# EAGLE schematic AI_Starter_Kit_for_Jetson_Nano_V1.0 (EAGLE 9.5.1)

## Sheet 1 of 2
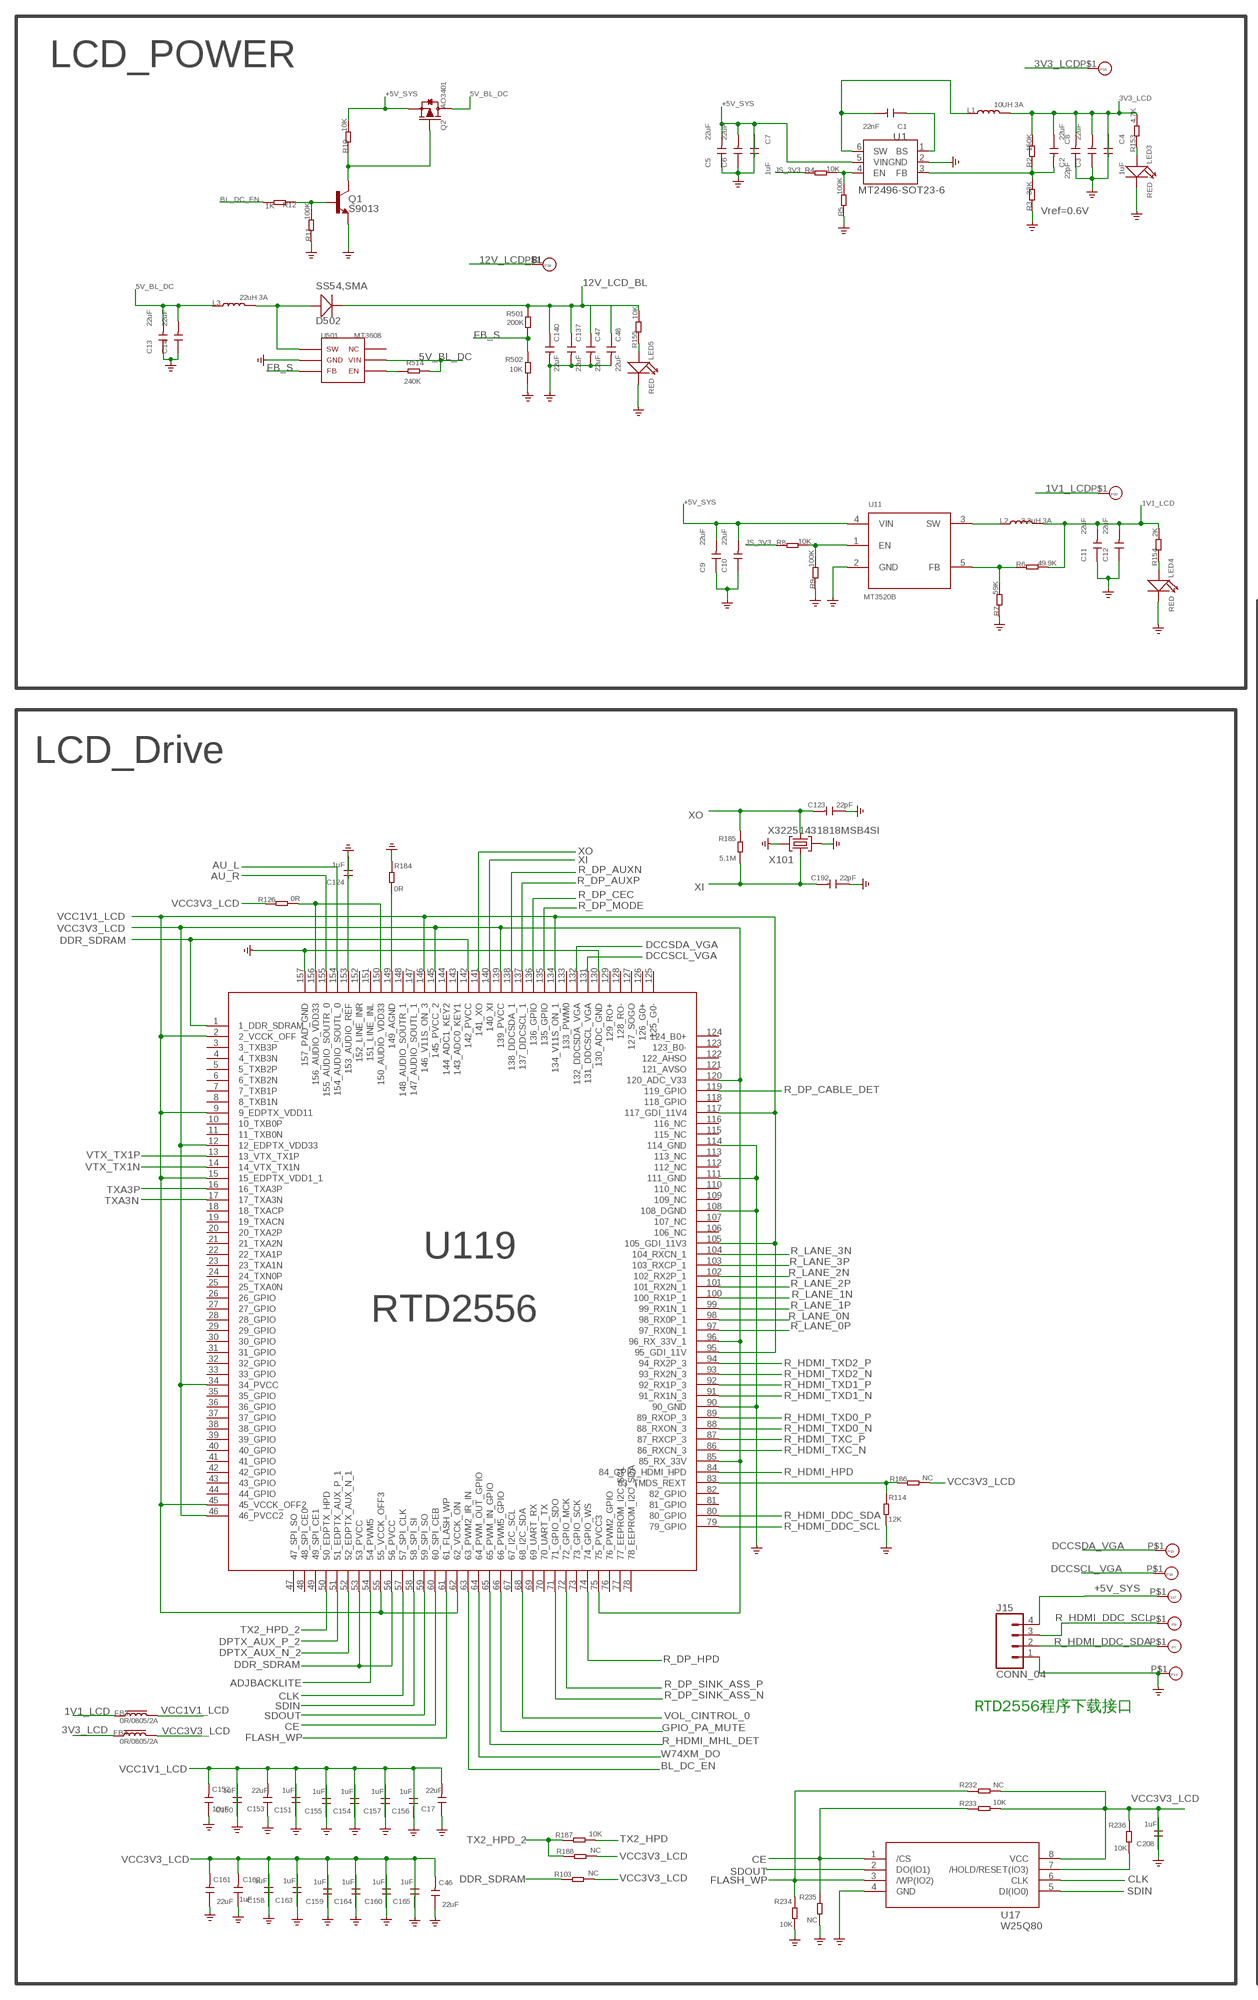
[diagram p0: schematic, sheet 1, part 1 of 2]
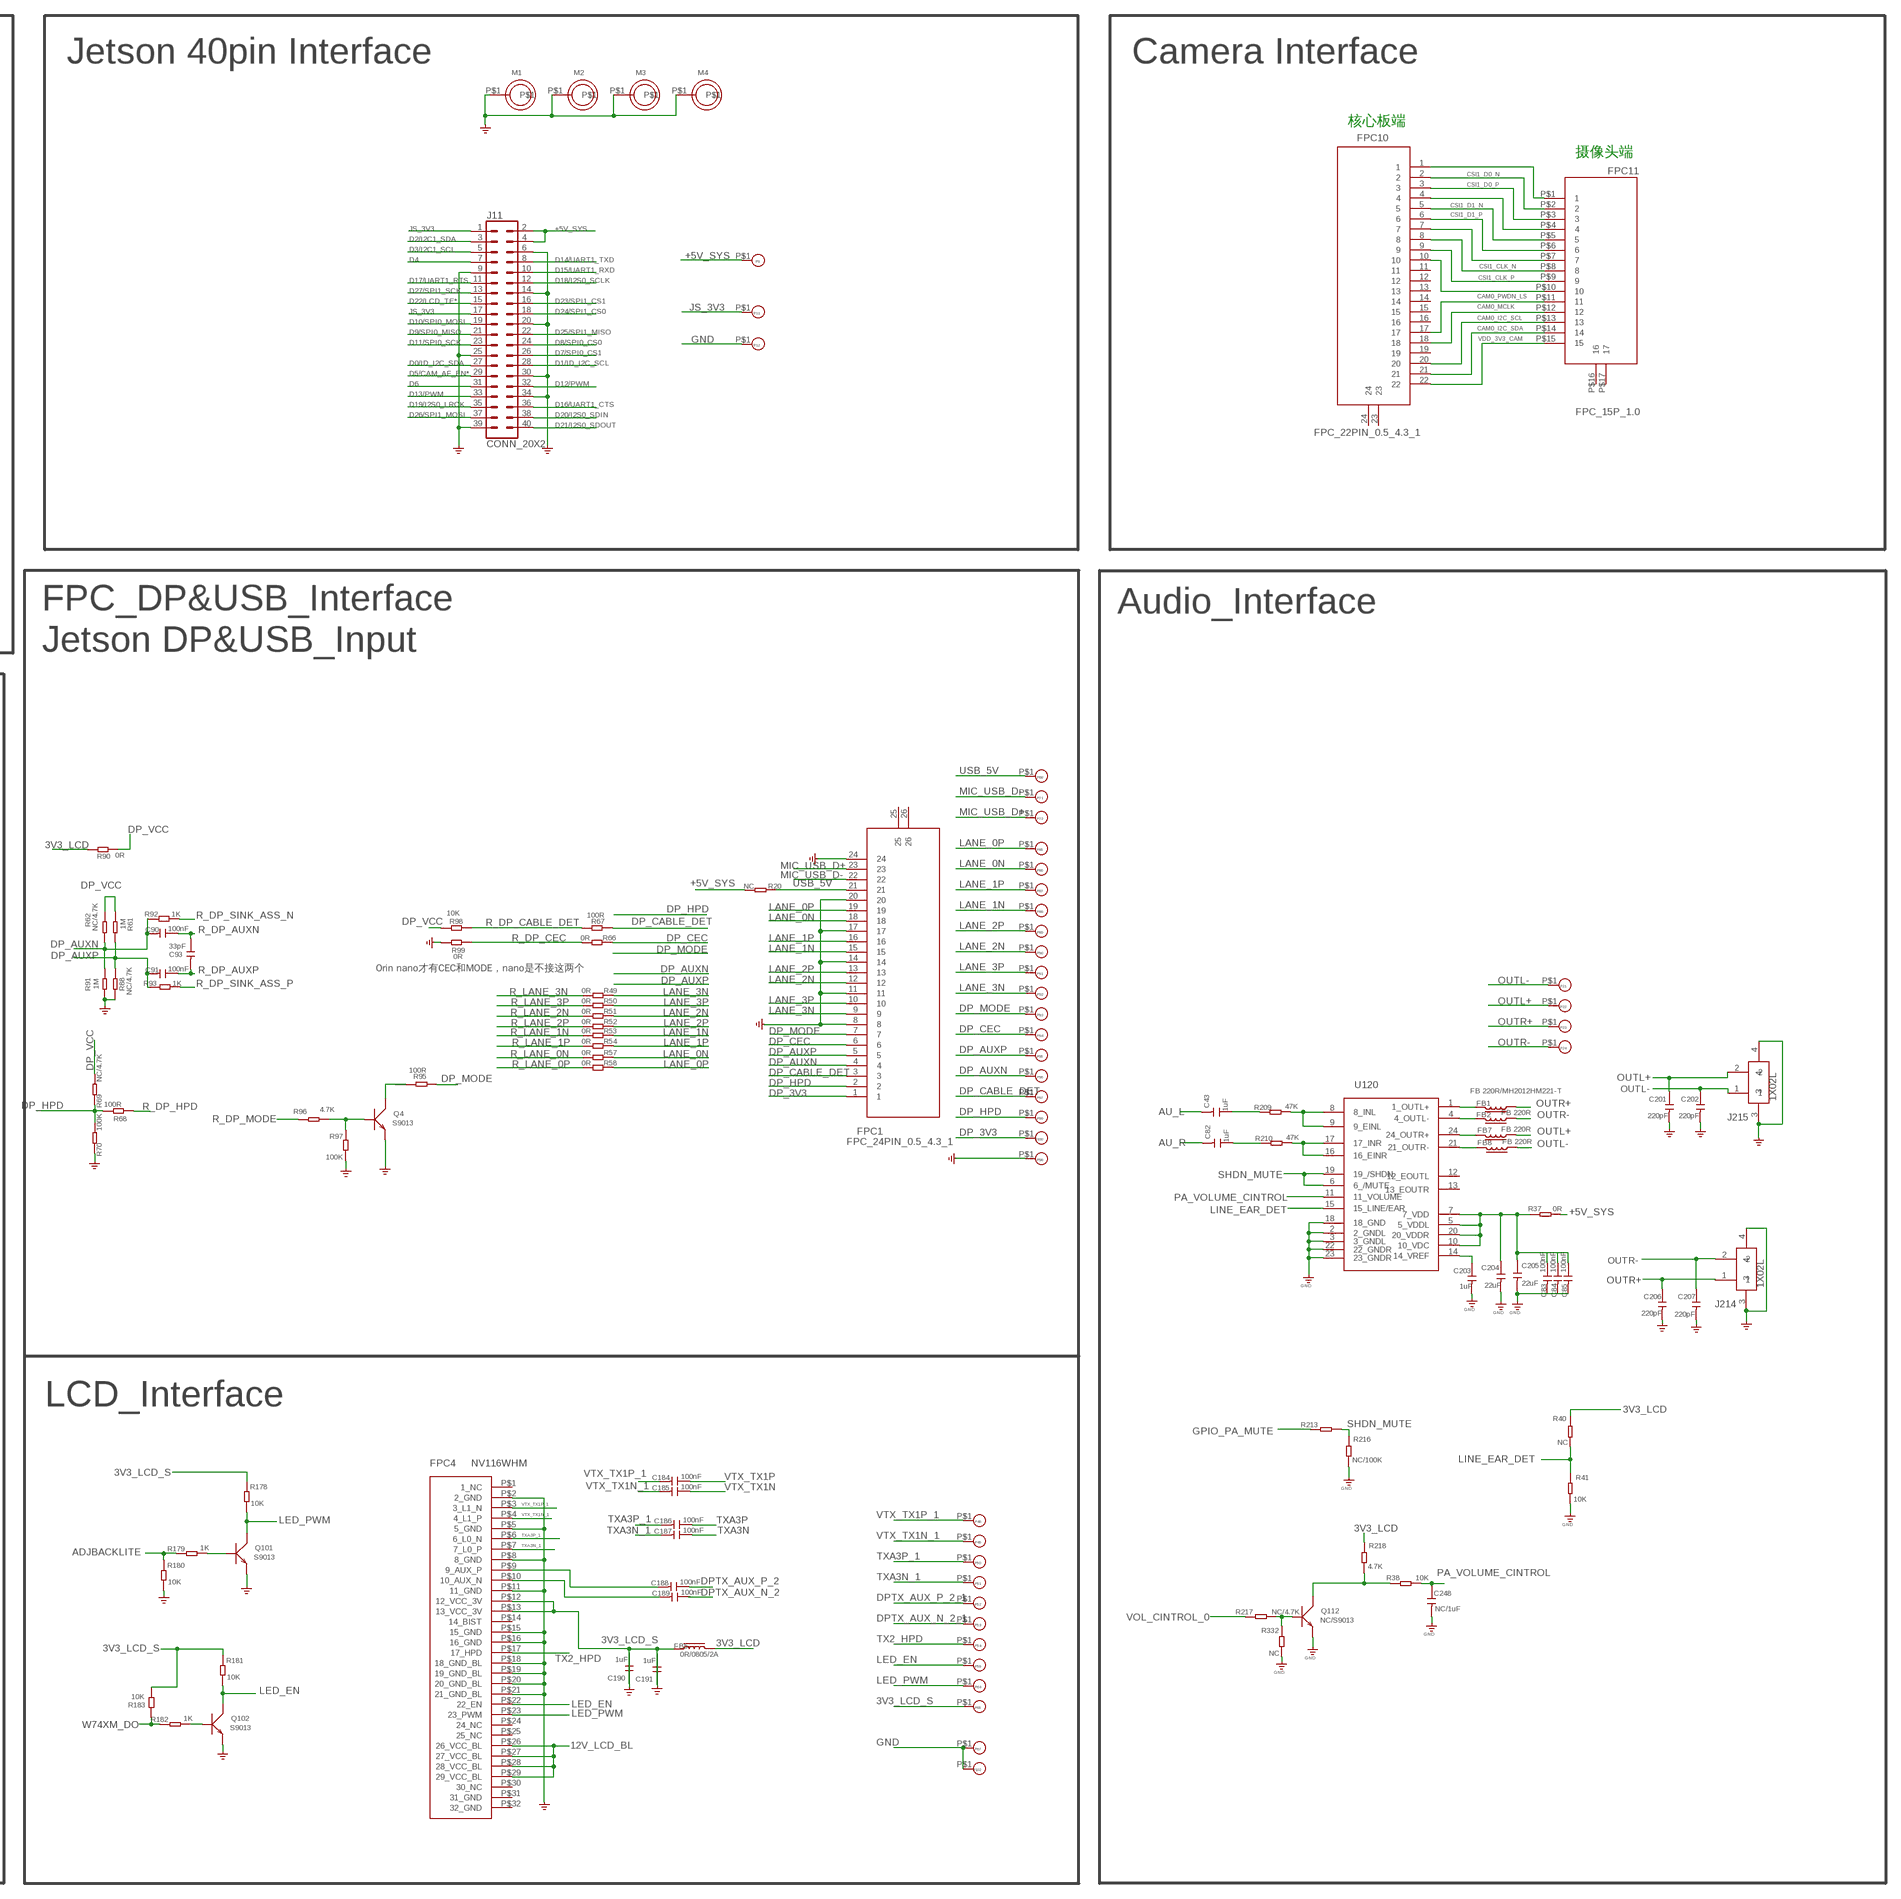
[diagram p1: schematic, sheet 1, part 2 of 2]

### Parts
C1  22nF  CAPC0603  [C0603]
C2  22uF  CAPC0805  [C0805]
C3  22uF  CAPC0805  [C0805]
C4  1uF  CAPC0603  [C0603]
C5  22uF  CAPC0805  [C0805]
C6  22uF  CAPC0805  [C0805]
C7  1uF  CAPC0603  [C0603]
C8  22pF  CAPC0603  [C0603]
C9  22uF  CAPC0805  [C0805]
C10  22uF  CAPC0805  [C0805]
C11  22uF  CAPC0805  [C0805]
C12  22uF  CAPC0805  [C0805]
C13  22uF  CAPC0805  [C0805]
C14  22uF  CAPC0805  [C0805]
C17  22uF  CAPC0805  [C0805]
C43  1uF  CAPC0603  [C0603]
C46  22uF  CAPC0805  [C0805]
C47  22uF  CAPC0805  [C0805]
C48  22uF  CAPC0805  [C0805]
C82  1uF  CAPC0603  [C0603]
C83  100nF  CAPC0603  [C0603]
C84  100nF  CAPC0603  [C0603]
C85  100nF  CAPC0603  [C0603]
C90  100nF  CAPC0402  [C0402]
C91  100nF  CAPC0402  [C0402]
C93  33pF  CAPC0402  [C0402]
C123  22pF  CAPC0603  [C0603]
C124  1uF  CAPC0603  [C0603]
C137  22uF  CAPC0805  [C0805]
C140  22uF  CAPC0805  [C0805]
C150  1uF  CAPC0603  [C0603]
C151  1uF  CAPC0603  [C0603]
C152  10uF  CAPC0805  [C0805]
C153  22uF  CAPC0805  [C0805]
C154  1uF  CAPC0603  [C0603]
C155  1uF  CAPC0603  [C0603]
C156  1uF  CAPC0603  [C0603]
C157  1uF  CAPC0603  [C0603]
C158  1uF  CAPC0603  [C0603]
C159  1uF  CAPC0603  [C0603]
C160  1uF  CAPC0603  [C0603]
C161  22uF  CAPC0805  [C0805]
C162  1uF  CAPC0603  [C0603]
C163  1uF  CAPC0603  [C0603]
C164  1uF  CAPC0603  [C0603]
C165  1uF  CAPC0603  [C0603]
C184  100nF  CAPC0603  [C0603]
C185  100nF  CAPC0603  [C0603]
C186  100nF  CAPC0603  [C0603]
C187  100nF  CAPC0603  [C0603]
C188  100nF  CAPC0603  [C0603]
C189  100nF  CAPC0603  [C0603]
C190  1uF  CAPC0603  [C0603]
C191  1uF  CAPC0603  [C0603]
C192  22pF  CAPC0603  [C0603]
C201  220pF  CAPC0603  [C0603]
C202  220pF  CAPC0603  [C0603]
C203  1uF  CAPC0603  [C0603]
C204  22uF  CAPC0805  [C0805]
C205  22uF  CAPC0805  [C0805]
C206  220pF  CAPC0603  [C0603]
C207  220pF  CAPC0603  [C0603]
C208  1uF  CAPC0603  [C0603]
C248  NC/1uF  CAPC0603  [C0603]
D502  SS54,SMA  214ABDO-214AB  [214AB]
FB1  FB 220R/MH2012HM221-T  FBL0805  [L0805]
FB2  FB 220R  FBL0805  [L0805]
FB3  0R/0805/2A  FBL0805  [L0805]
FB4  0R/0805/2A  FBL0805  [L0805]
FB5  0R/0805/2A  FBL0805  [L0805]
FB7  FB 220R  FBL0805  [L0805]
FB8  FB 220R  FBL0805  [L0805]
FPC1  FPC_24PIN_0.5_4.3_1  [FPC_24PIN_0.5_4.3_1]
FPC4  NV116WHM  [30P*0.5MM]
FPC10  FPC_22PIN_0.5_4.3_1  [FPC_22PIN_0.5_4.3_1]
FPC11  FPC_15P_1.0  [FPC_P1.0MM_15P_SMD]
J11  CONN_20X2  [2X20]
J15  CONN_04  [1X04]
J214  1X02L  [1X02L]
J215  1X02L  [1X02L]
L1  10UH 3A  LL773  [L773]
L2  3.3uH 3A  LL0420  [L0420]
L3  22uH 3A  LL773  [L773]
LED3  RED  DISCRETE_LED0603  [DISCRETE_LED-0603]
LED4  RED  DISCRETE_LED0603  [DISCRETE_LED-0603]
LED5  RED  DISCRETE_LED0603  [DISCRETE_LED-0603]
M1  M2  [M2]
M2  M2  [M2]
M3  M2  [M2]
M4  M2  [M2]
P7  PADPAD-1.0MM  [PAD-1.0MM]
P8  PADPAD-1.0MM  [PAD-1.0MM]
P9  PADPAD-1.0MM  [PAD-1.0MM]
P11  PADPAD-1.0MM  [PAD-1.0MM]
P12  PADPAD-1.0MM  [PAD-1.0MM]
P14  PADPAD-1.0MM  [PAD-1.0MM]
P15  PADPAD-1.0MM  [PAD-1.0MM]
P16  PADPAD-1.0MM  [PAD-1.0MM]
P18  PADPAD-1.0MM  [PAD-1.0MM]
P19  PADPAD-1.0MM  [PAD-1.0MM]
P20  PADPAD-1.0MM  [PAD-1.0MM]
P21  PADPAD-1.0MM  [PAD-1.0MM]
P22  PADPAD-1.0MM  [PAD-1.0MM]
P23  PADPAD-1.0MM  [PAD-1.0MM]
P24  PADPAD-1.0MM  [PAD-1.0MM]
P48  PADPAD-1.0MM  [PAD-1.0MM]
P49  PADPAD-1.0MM  [PAD-1.0MM]
P50  PADPAD-1.0MM  [PAD-1.0MM]
P51  PADPAD-1.0MM  [PAD-1.0MM]
P52  PADPAD-1.0MM  [PAD-1.0MM]
P53  PADPAD-1.0MM  [PAD-1.0MM]
P54  PADPAD-1.0MM  [PAD-1.0MM]
P58  PADPAD-1.0MM  [PAD-1.0MM]
P64  PADPAD-1.0MM  [PAD-1.0MM]
P65  PADPAD-1.0MM  [PAD-1.0MM]
P67  PADPAD-1.0MM  [PAD-1.0MM]
P68  PADPAD-1.0MM  [PAD-1.0MM]
P71  PADPAD-1.0MM  [PAD-1.0MM]
P72  PADPAD-1.0MM  [PAD-1.0MM]
P85  PADPAD-1.0MM  [PAD-1.0MM]
P86  PADPAD-1.0MM  [PAD-1.0MM]
P87  PADPAD-1.0MM  [PAD-1.0MM]
P88  PADPAD-1.0MM  [PAD-1.0MM]
P89  PADPAD-1.0MM  [PAD-1.0MM]
P90  PADPAD-1.0MM  [PAD-1.0MM]
P91  PADPAD-1.0MM  [PAD-1.0MM]
P92  PADPAD-1.0MM  [PAD-1.0MM]
P93  PADPAD-1.0MM  [PAD-1.0MM]
P94  PADPAD-1.0MM  [PAD-1.0MM]
P95  PADPAD-1.0MM  [PAD-1.0MM]
P96  PADPAD-1.0MM  [PAD-1.0MM]
P97  PADPAD-1.0MM  [PAD-1.0MM]
P98  PADPAD-1.0MM  [PAD-1.0MM]
P99  PADPAD-1.0MM  [PAD-1.0MM]
P100  PADPAD-1.0MM  [PAD-1.0MM]
P102  PADPAD-1.0MM  [PAD-1.0MM]
P117  PADPAD-1.0MM  [PAD-1.0MM]
Q1  S9013  TRANS_NPN-MMBTA42  [SOT23-3]
Q2  AO3401  MOSFET-PSOT23  [PMOS_SOT23]
Q4  S9013  TRANSISTOR-NPN-SOT23  [SOT23@1]
Q101  S9013  TRANSISTOR-NPN-SOT23  [SOT23@1]
Q102  S9013  TRANSISTOR-NPN-SOT23  [SOT23@1]
Q112  NC/S9013  TRANSISTOR-NPN-SOT23  [SOT23@1]
R2  150K  RESR0603  [R0603]
R3  33K  RESR0603  [R0603]
R4  10K  RESR0603  [R0603]
R5  100K  RESR0603  [R0603]
R6  49.9K  RESR0603  [R0603]
R7  59K  RESR0603  [R0603]
R8  10K  RESR0603  [R0603]
R9  100K  RESR0603  [R0603]
R10  10K  RESR0603  [R0603]
R11  100K  RESR0603  [R0603]
R12  1K  RESR0603  [R0603]
R20  NC  RESR0603  [R0603]
R37  0R  RESR0603  [R0603]
R38  10K  RESR0603  [R0603]
R40  NC  RESR0603  [R0603]
R41  10K  RESR0603  [R0603]
R49  0R  RESR0402  [R0402]
R50  0R  RESR0402  [R0402]
R51  0R  RESR0402  [R0402]
R52  0R  RESR0402  [R0402]
R53  0R  RESR0402  [R0402]
R54  0R  RESR0402  [R0402]
R57  0R  RESR0402  [R0402]
R58  0R  RESR0402  [R0402]
R61  1M  RESR0402  [R0402]
R62  NC/4.7K  RESR0402  [R0402]
R66  0R  RESR0402  [R0402]
R67  100R  RESR0402  [R0402]
R68  100R  RESR0402  [R0402]
R69  NC/4.7K  RESR0402  [R0402]
R70  100K  RESR0402  [R0402]
R88  NC/4.7K  RESR0402  [R0402]
R90  0R  RESR0402  [R0402]
R91  1M  RESR0402  [R0402]
R92  1K  RESR0402  [R0402]
R93  1K  RESR0402  [R0402]
R95  100R  RESR0402  [R0402]
R96  4.7K  RESR0402  [R0402]
R97  100K  RESR0402  [R0402]
R98  10K  RESR0402  [R0402]
R99  0R  RESR0402  [R0402]
R103  NC  RESR0603  [R0603]
R114  12K  RESR0603  [R0603]
R126  0R  RESR0603  [R0603]
R153  4.7K  RESR0603  [R0603]
R154  2K  RESR0603  [R0603]
R155  10K  RESR0603  [R0603]
R178  10K  RESR0603  [R0603]
R179  1K  RESR0603  [R0603]
R180  10K  RESR0603  [R0603]
R181  10K  RESR0603  [R0603]
R182  1K  RESR0603  [R0603]
R183  10K  RESR0603  [R0603]
R184  0R  RESR0603  [R0603]
R185  5.1M  RESR0603  [R0603]
R186  NC  RESR0603  [R0603]
R187  10K  RESR0603  [R0603]
R188  NC  RESR0603  [R0603]
R209  47K  RESR0603  [R0603]
R210  47K  RESR0603  [R0603]
R213  0R  RESR0603  [R0603]
R216  NC/100K  RESR0603  [R0603]
R217  NC/4.7K  RESR0603  [R0603]
R218  4.7K  RESR0603  [R0603]
R232  NC  RESR0603  [R0603]
R233  10K  RESR0603  [R0603]
R234  10K  RESR0603  [R0603]
R235  NC  RESR0603  [R0603]
R236  10K  RESR0603  [R0603]
R332  NC  RESR0603  [R0603]
R501  200K  RESR0603  [R0603]
R502  10K  RESR0603  [R0603]
R514  240K  RESR0603  [R0603]
U1  MT2496-SOT23-6  MT2492-SOT23-6  [SOT23-6L]
U11  MT3520B  [IC_SOT23-5]
U17  W25Q80  LORA_RA-08H_DEV_SELF_W25Q128JV  [LORA_RA-08H_DEV_SELF_SOIC-8-208MIL]
U119  RTD2556  IC_RTD2556_LQFP156_14X20  [IC_RTD2556_LQFP156_14X20]
U120  PAM8602E_SSOP24  [SSOP24]
U501  MT3608  [MT3608-SOT23-6]
X101  X32251431818MSB4SI  CRYSTAL-3.2-2.5  [CRYSTAL-3.2-2.5]

### Nets
1V1_LCD: C11.2 C12.2 FB3.1 L2.2 P20.P$1 R6.2 R154.2
3V3_AU: R126.2 U119.150(150_AUDIO_VDD33) U119.156(156_AUDIO_VDD33)
3V3_LCD: C2.2 C3.2 C4.2 C8.1 FB4.1 FB5.2 L1.2 P19.P$1 R2.2 R40.1 R90.1 R153.2 R218.2
3V3_LCD_S: C190.2 C191.2 FB5.1 FPC4.P$12(12_VCC_3V) FPC4.P$13(13_VCC_3V) P65.P$1 R178.2 R181.2 R183.2
5V_BL_DC: C13.2 C14.2 L3.1 Q2.3(D) R514.2 U501.5
12V_LCD_BL: C47.1 C48.1 C137.1 C140.1 D502.2(-) FPC4.P$26(26_VCC_BL) FPC4.P$27(27_VCC_BL) FPC4.P$28(28_VCC_BL) FPC4.P$29(29_VCC_BL) P18.P$1 R155.2 R501.1
+5V_SYS [PWR]: C5.2 C6.2 C7.2 C9.2 C10.2 J11.2 J11.4 J15.4 P9.P$1 P117.P$1 Q2.2(S) R10.2 R20.1 R37.2 U1.5(VIN) U11.4(VIN) ; also sheet 2
A_GND: R184.1 U119.149(149_AGND)
ADJBACKLITE: R179.2 R180.2 U119.54(54_PWM5)
AU_L: C43.2 U119.154(154_AUDIO_SOUTL_0)
AU_R: C82.2 U119.155(155_AUDIO_SOUTR_0)
BL_DC_EN: R12.2 U119.63(63_PWM2_IR_IN)
CAM0_I2C_SCL: FPC10.20 FPC11.P$13
CAM0_I2C_SDA: FPC10.21 FPC11.P$14
CAM0_MCLK: FPC10.18 FPC11.P$12
CAM0_PWDN_LS: FPC10.17 FPC11.P$11
CE: R233.2 R235.2 U17.1(/CS) U119.60(60_SPI_CEB)
CLK: U17.6(CLK) U119.57(57_SPI_CLK)
CSI1_CLK_N: FPC10.8 FPC11.P$8
CSI1_CLK_P: FPC10.9 FPC11.P$9
CSI1_D0_N: FPC10.2 FPC11.P$2
CSI1_D0_P: FPC10.3 FPC11.P$3
CSI1_D1_N: FPC10.5 FPC11.P$5
CSI1_D1_P: FPC10.6 FPC11.P$6
CSI_GND: FPC10.1 FPC10.4 FPC10.7 FPC10.10 FPC11.P$1 FPC11.P$4 FPC11.P$7 FPC11.P$10
D0/ID_I2C_SDA: J11.27
D1/ID_I2C_SCL: J11.28
D2/I2C1_SDA: J11.3 ; also sheet 2
D3/I2C1_SCL: J11.5 ; also sheet 2
D4: J11.7 ; also sheet 2
D5/CAM_AF_EN*: J11.29
D6: J11.31 ; also sheet 2
D7/SPI0_CS1: J11.26
D8/SPI0_CS0: J11.24 ; also sheet 2
D9/SPI0_MISO: J11.21 ; also sheet 2
D10/SPI0_MOSI: J11.19 ; also sheet 2
D11/SPI0_SCK: J11.23 ; also sheet 2
D12/PWM: J11.32 ; also sheet 2
D13/PWM: J11.33 ; also sheet 2
D14/UART1_TXD: J11.8 ; also sheet 2
D15/UART1_RXD: J11.10 ; also sheet 2
D16/UART1_CTS: J11.36 ; also sheet 2
D17/UART1_RTS: J11.11 ; also sheet 2
D18/I2S0_SCLK: J11.12 ; also sheet 2
D19/I2S0_LRCK: J11.35
D20/I2S0_SDIN: J11.38 ; also sheet 2
D21/I2S0_SDOUT: J11.40
D22/LCD_TE*: J11.15
D23/SPI1_CS1: J11.16 ; also sheet 2
D24/SPI1_CS0: J11.18
D25/SPI1_MISO: J11.22 ; also sheet 2
D26/SPI1_MOSI: J11.37 ; also sheet 2
D27/SPI1_SCK: J11.13 ; also sheet 2
DCCSCL_VGA: P16.P$1 U119.131(131_DDCSCL_VGA)
DCCSDA_VGA: P15.P$1 U119.132(132_DDCSDA_VGA)
DDR_SDRAM: R103.1 U119.1(1_DDR_SDRAM) U119.53(53_PVCC) U119.56(56_PVCC) U119.142(142_PVCC)
DP_3V3: FPC1.1 P100.P$1
DP_AUXN: C90.2 FPC1.4 P96.P$1 R62.2 R91.1 R92.1
DP_AUXP: C91.2 FPC1.5 P95.P$1 R61.2 R88.1 R93.1
DP_CABLE_DET: FPC1.3 P97.P$1 R67.2
DP_CEC: FPC1.6 P94.P$1 R66.2
DP_HPD: FPC1.2 P99.P$1 R68.1 R69.2 R70.1
DP_MODE: FPC1.7 P93.P$1 R95.2
DP_VCC: R61.1 R62.1 R69.1 R90.2 R98.1
DPTX_AUX_N_2: C189.1 U119.52(52_EDPTX_AUX_N_1)
DPTX_AUX_N_2_1: C189.2 FPC4.P$10(10_AUX_N) P53.P$1
DPTX_AUX_P_2: C188.1 U119.51(51_EDPTX_AUX_P_1)
DPTX_AUX_P_2_1: C188.2 FPC4.P$9(9_AUX_P) P52.P$1
FB_S: R501.2 R502.1 U501.3
FLASH_WP: R232.1 R234.2 U17.3(/WP(IO2)) U119.61(61_FLASH_WP)
GND [PWR]: C2.1 C3.1 C4.1 C5.1 C6.1 C7.1 C9.1 C10.1 C11.1 C12.1 C13.1 C14.1 C17.1 C46.1 C47.2 C48.2 C83.2 C84.2 C85.2 C123.1 C124.2 C137.2 C140.2 C150.1 C151.1 C152.1 C153.1 C154.1 C155.1 C156.1 C157.1 C158.1 C159.1 C160.1 C161.1 C162.1 C163.1 C164.1 C165.1 C190.1 C191.1 C192.1 C201.2 C202.2 C203.2 C204.2 C205.2 C206.2 C207.2 C208.1 C248.2 FPC1.8 FPC1.11 FPC1.14 FPC1.17 FPC1.20 FPC1.24 FPC4.P$2(2_GND) FPC4.P$5(5_GND) FPC4.P$8(8_GND) FPC4.P$11(11_GND) FPC4.P$15(15_GND) FPC4.P$16(16_GND) FPC4.P$18(18_GND_BL) FPC4.P$19(19_GND_BL) FPC4.P$20(20_GND_BL) FPC4.P$21(21_GND_BL) J11.6 J11.9 J11.14 J11.20 J11.25 J11.30 J11.34 J11.39 J15.1 J214.3 J214.4 J215.3 J215.4 LED3.- LED4.- LED5.- M1.P$1 M2.P$1 M3.P$1 M4.P$1 P12.P$1 P14.P$1 P67.P$1 P98.P$1 P102.P$1 Q1.2(E) Q4.2(E) Q101.2(E) Q102.2(E) Q112.2(E) R3.1 R5.1 R7.1 R9.1 R11.1 R41.2 R70.2 R88.2 R91.2 R97.1 R99.1 R114.2 R180.1 R184.2 R216.1 R234.1 R235.1 R332.2 R502.2 U1.2(GND) U11.2(GND) U17.4(GND) U119.90(90_GND) U119.108(108_DGND) U119.111(111_GND) U119.114(114_GND) U119.130(130_ADC_GND) U119.157(157_PAD_GND) U120.2(2_GNDL) U120.3(3_GNDL) U120.18(18_GND) U120.22(22_GNDR) U120.23(23_GNDR) U501.2 X101.2(GND) X101.4(GND) ; supply symbol labelled POWER-OR-GND-_GND_POWER ; also sheet 2
GPIO_PA_MUTE: R213.1 U119.66(66_PWM5_GPIO)
HOLD(DQ3): R236.1 U17.7(/HOLD/RESET(IO3))
JS_3V3 [PWR]: J11.1 J11.17 P11.P$1 R4.1 R8.1 ; also sheet 2
LANE_0N: FPC1.18 P86.P$1 R57.2
LANE_0P: FPC1.19 P85.P$1 R58.2
LANE_1N: FPC1.15 P88.P$1 R53.2
LANE_1P: FPC1.16 P87.P$1 R54.2
LANE_2N: FPC1.12 P90.P$1 R51.2
LANE_2P: FPC1.13 P89.P$1 R52.2
LANE_3N: FPC1.9 P92.P$1 R49.2
LANE_3P: FPC1.10 P91.P$1 R50.2
LED_EN: FPC4.P$22(22_EN) P58.P$1 Q102.3(C) R181.1
LED_PWM: FPC4.P$23(23_PWM) P64.P$1 Q101.3(C) R178.1
LINE_EAR_DET: R40.2 R41.1 U120.15(15_LINE/EAR)
MIC_USB_D+: FPC1.23 P72.P$1 ; also sheet 2
MIC_USB_D-: FPC1.22 P71.P$1 ; also sheet 2
N$3: C1.2 L1.1 U1.6(SW)
N$4: C1.1 U1.1(BS)
N$5: C8.2 R2.1 R3.2 U1.3(FB)
N$6: R4.2 R5.2 U1.4(EN)
N$7: R8.2 R9.2 U11.1(EN)
N$8: Q1.1(B) R11.2 R12.1
N$9: Q1.3(C) Q2.1(G) R10.1
N$39: Q102.1(B) R182.1
N$42: R209.1 U120.8(8_INL) U120.9(9_EINL)
N$43: R210.1 U120.16(16_EINR) U120.17(17_INR)
N$51: C83.1 C84.1 C85.1 C204.1 C205.1 R37.1 U120.5(5_VDDL) U120.7(7_VDD) U120.10(10_VDC) U120.20(20_VDDR)
N$52: C203.1 U120.14(14_VREF)
N$53: FB1.2 U120.1(1_OUTL+)
N$54: FB2.2 U120.4(4_OUTL-)
N$58: FB7.2 U120.24(24_OUTR+)
N$59: FB8.2 U120.21(21_OUTR-)
N$61: C82.1 R210.2
N$62: C43.1 R209.2
N$63: Q112.1(B) R217.2 R332.1
N$64: Q101.1(B) R179.1
N$65: Q112.3(C) R38.2 R218.1
N$66: C124.1 U119.153(153_AUDIO_REF)
N$74: LED3.+ R153.1
N$75: L2.1 U11.3(SW)
N$76: LED4.+ R154.1
N$77: LED5.+ R155.1
N$78: R6.1 R7.2 U11.5(FB)
N$91: Q4.3(C) R95.1
N$92: Q4.1(B) R96.2 R97.2
N$127: D502.1(+) L3.2 U501.1
N$128: R514.1 U501.4
OUTL+: C201.1 FB7.1 J215.2 P22.P$1
OUTL-: C202.1 FB8.1 J215.1 P21.P$1
OUTR+: C206.1 FB1.1 J214.1 P23.P$1
OUTR-: C207.1 FB2.1 J214.2 P24.P$1
PA_VOLUME_CINTROL: C248.1 R38.1 U120.11(11_VOLUME)
R_DP_AUXN: C90.1 C93.1 U119.138(138_DDCSDA_1)
R_DP_AUXP: C91.1 C93.2 U119.137(137_DDCSCL_1)
R_DP_CABLE_DET: R67.1 R98.2 U119.119(119_GPIO)
R_DP_CEC: R66.1 R99.2 U119.136(136_GPIO)
R_DP_HPD: R68.2 U119.74(74_GPIO_WS)
R_DP_MODE: R96.1 U119.135(135_GPIO)
R_DP_SINK_ASS_N: R92.2 U119.71(71_GPIO_SDO)
R_DP_SINK_ASS_P: R93.2 U119.72(72_GPIO_MCK)
R_HDMI_DDC_SCL: J15.3 P8.P$1 U119.79(79_GPIO)
R_HDMI_DDC_SDA: J15.2 P7.P$1 U119.80(80_GPIO)
R_HDMI_HPD: U119.84(84_GPIO_HDMI_HPD)
R_HDMI_MHL_DET: U119.65(65_PWM_IN_GPIO)
R_HDMI_TXC_N: U119.86(86_RXCN_3)
R_HDMI_TXC_P: U119.87(87_RXCP_3)
R_HDMI_TXD0_N: U119.88(88_RXON_3)
R_HDMI_TXD0_P: U119.89(89_RXOP_3)
R_HDMI_TXD1_N: U119.91(91_RX1N_3)
R_HDMI_TXD1_P: U119.92(92_RX1P_3)
R_HDMI_TXD2_N: U119.93(93_RX2N_3)
R_HDMI_TXD2_P: U119.94(94_RX2P_3)
R_LANE_0N: R57.1 U119.98(98_RX0P_1)
R_LANE_0P: R58.1 U119.97(97_RX0N_1)
R_LANE_1N: R53.1 U119.100(100_RX1P_1)
R_LANE_1P: R54.1 U119.99(99_RX1N_1)
R_LANE_2N: R51.1 U119.102(102_RX2P_1)
R_LANE_2P: R52.1 U119.101(101_RX2N_1)
R_LANE_3N: R49.1 U119.104(104_RXCN_1)
R_LANE_3P: R50.1 U119.103(103_RXCP_1)
SDIN: U17.5(DI(IO0)) U119.58(58_SPI_SI)
SDOUT: U17.2(DO(IO1)) U119.59(59_SPI_SO)
SHDN_MUTE: R213.2 R216.2 U120.6(6_/MUTE) U120.19(19_/SHDN)
TMDS_REXT: R114.1 R186.1 U119.83(83_TMDS_REXT)
TX2_HPD: FPC4.P$17(17_HPD) P54.P$1 R187.2
TX2_HPD_2: R187.1 R188.1 U119.50(50_EDPTX_HPD)
TXA3N: C187.1 U119.17(17_TXA3N)
TXA3N_1: C187.2 FPC4.P$7(7_L0_P) P51.P$1
TXA3P: C186.1 U119.16(16_TXA3P)
TXA3P_1: C186.2 FPC4.P$6(6_L0_N) P50.P$1
USB_5V: FPC1.21 P68.P$1 R20.2
VCC1V1_LCD: C17.2 C150.2 C151.2 C152.2 C153.2 C154.2 C155.2 C156.2 C157.2 FB3.2 U119.2(2_VCCK_OFF) U119.9(9_EDPTX_VDD11) U119.15(15_EDPTX_VDD1_1) U119.45(45_VCCK_OFF2) U119.55(55_VCCK_OFF3) U119.62(62_VCCK_ON) U119.95(95_GDI_11V) U119.105(105_GDI_11V3) U119.117(117_GDI_11V4) U119.134(134_V11S_ON_1) U119.146(146_V11S_ON_3)
VCC3V3_LCD: C46.2 C158.2 C159.2 C160.2 C161.2 C162.2 C163.2 C164.2 C165.2 C208.2 FB4.2 R103.2 R126.1 R186.2 R188.2 R232.2 R233.1 R236.2 U17.8(VCC) U119.12(12_EDPTX_VDD33) U119.34(34_PVCC) U119.46(46_PVCC2) U119.75(75_PVCC3) U119.85(85_RX_33V) U119.96(96_RX_33V_1) U119.120(120_ADC_V33) U119.139(139_PVCC) U119.145(145_PVCC_2)
VDD_3V3_CAM: FPC10.22 FPC11.P$15
VOL_CINTROL_0: R217.1 U119.68(68_I2C_SDA)
VTX_TX1N: C185.1 U119.14(14_VTX_TX1N)
VTX_TX1N_1: C185.2 FPC4.P$4(4_L1_P) P49.P$1
VTX_TX1P: C184.1 U119.13(13_VTX_TX1P)
VTX_TX1P_1: C184.2 FPC4.P$3(3_L1_N) P48.P$1
W74XM_DO: R182.2 R183.1 U119.64(64_PWM_OUT_GPIO)
XI: C192.2 R185.1 U119.140(140_XI) X101.3(C2)
XO: C123.2 R185.2 U119.141(141_XO) X101.1(C1)
Unconnected: FPC1.25 FPC1.26 FPC4.P$1(1_NC) FPC4.P$14(14_BIST) FPC4.P$24(24_NC) FPC4.P$25(25_NC) FPC4.P$30(30_NC) FPC4.P$31(31_GND) FPC4.P$32(32_GND) FPC10.11 FPC10.12 FPC10.13 FPC10.14 FPC10.15 FPC10.16 FPC10.19 FPC10.23 FPC10.24 FPC11.P$16 FPC11.P$17 U119.3(3_TXB3P) U119.4(4_TXB3N) U119.5(5_TXB2P) U119.6(6_TXB2N) U119.7(7_TXB1P) U119.8(8_TXB1N) U119.10(10_TXB0P) U119.11(11_TXB0N) U119.18(18_TXACP) U119.19(19_TXACN) U119.20(20_TXA2P) U119.21(21_TXA2N) U119.22(22_TXA1P) U119.23(23_TXA1N) U119.24(24_TXN0P) U119.25(25_TXA0N) U119.26(26_GPIO) U119.27(27_GPIO) U119.28(28_GPIO) U119.29(29_GPIO) U119.30(30_GPIO) U119.31(31_GPIO) U119.32(32_GPIO) U119.33(33_GPIO) U119.35(35_GPIO) U119.36(36_GPIO) U119.37(37_GPIO) U119.38(38_GPIO) U119.39(39_GPIO) U119.40(40_GPIO) U119.41(41_GPIO) U119.42(42_GPIO) U119.43(43_GPIO) U119.44(44_GPIO) U119.47(47_SPI_SO) U119.48(48_SPI_CE0) U119.49(49_SPI_CE1) U119.67(67_I2C_SCL) U119.69(69_UART_RX) U119.70(70_UART_TX) U119.73(73_GPIO_SCK) U119.76(76_PWM2_GPIO) U119.77(77_EEPROM_I2C_SCL) U119.78(78_EEPROM_I2C_SDA) U119.81(81_GPIO) U119.82(82_GPIO) U119.106(106_NC) U119.107(107_NC) U119.109(109_NC) U119.110(110_NC) U119.112(112_NC) U119.113(113_NC) U119.115(115_NC) U119.116(116_NC) U119.118(118_GPIO) U119.121(121_AVSO) U119.122(122_AHSO) U119.123(123_B0-) U119.124(124_B0+) U119.125(125_G0-) U119.126(126_G0+) U119.127(127_SOGO) U119.128(128_RO-) U119.129(129_RO+) U119.133(133_PWM0) U119.143(143_ADC0_KEY1) U119.144(144_ADC1_KEY2) U119.147(147_AUDIO_SOUTL_1) U119.148(148_AUDIO_SOUTR_1) U119.151(151_LINE_INL) U119.152(152_LINE_INR) U120.12(12_EOUTL) U120.13(13_EOUTR) U501.6

### Notes on the sheet
- LCD_POWER | Jetson 40pin Interface | Camera Interface
- 核心板端
- 摄像头端
- Vref=0.6V
- FPC_DP&USB_Interface | Audio_Interface
- Jetson DP&USB_Input
- LCD_Drive
- Orin nano才有CEC和MODE，nano是不接这两个
- LCD_Interface
- RTD2556程序下载接口

## Sheet 2 of 2
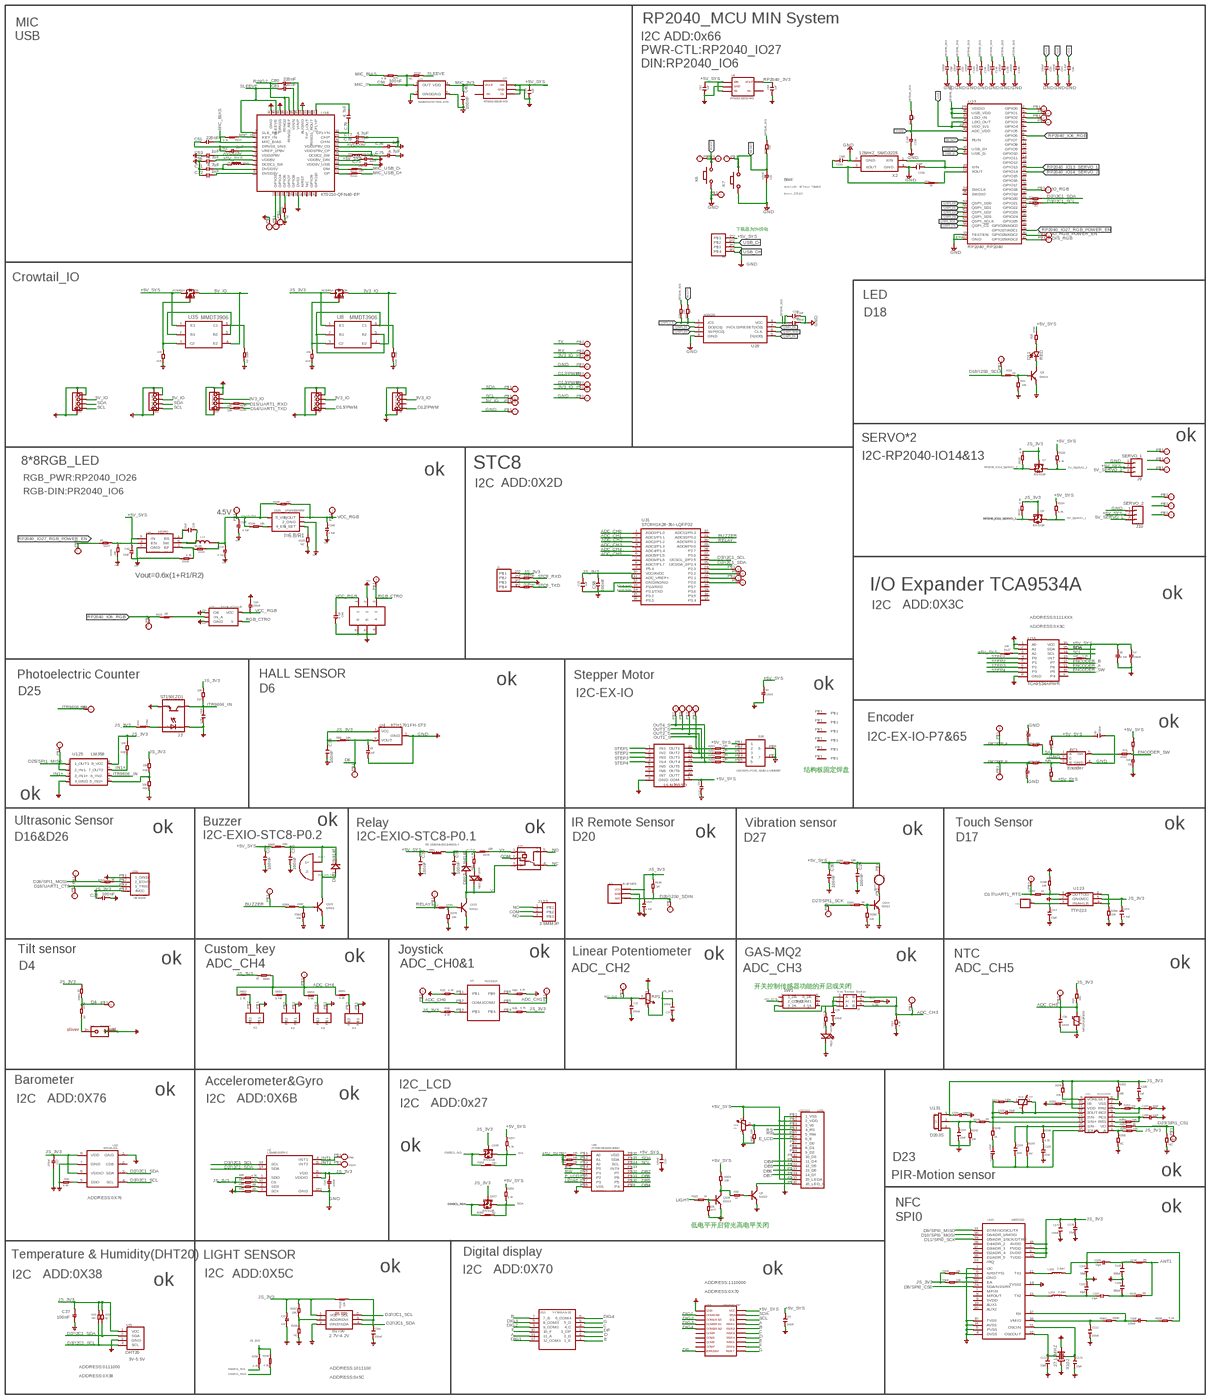
[diagram p2: schematic, sheet 2, overview]
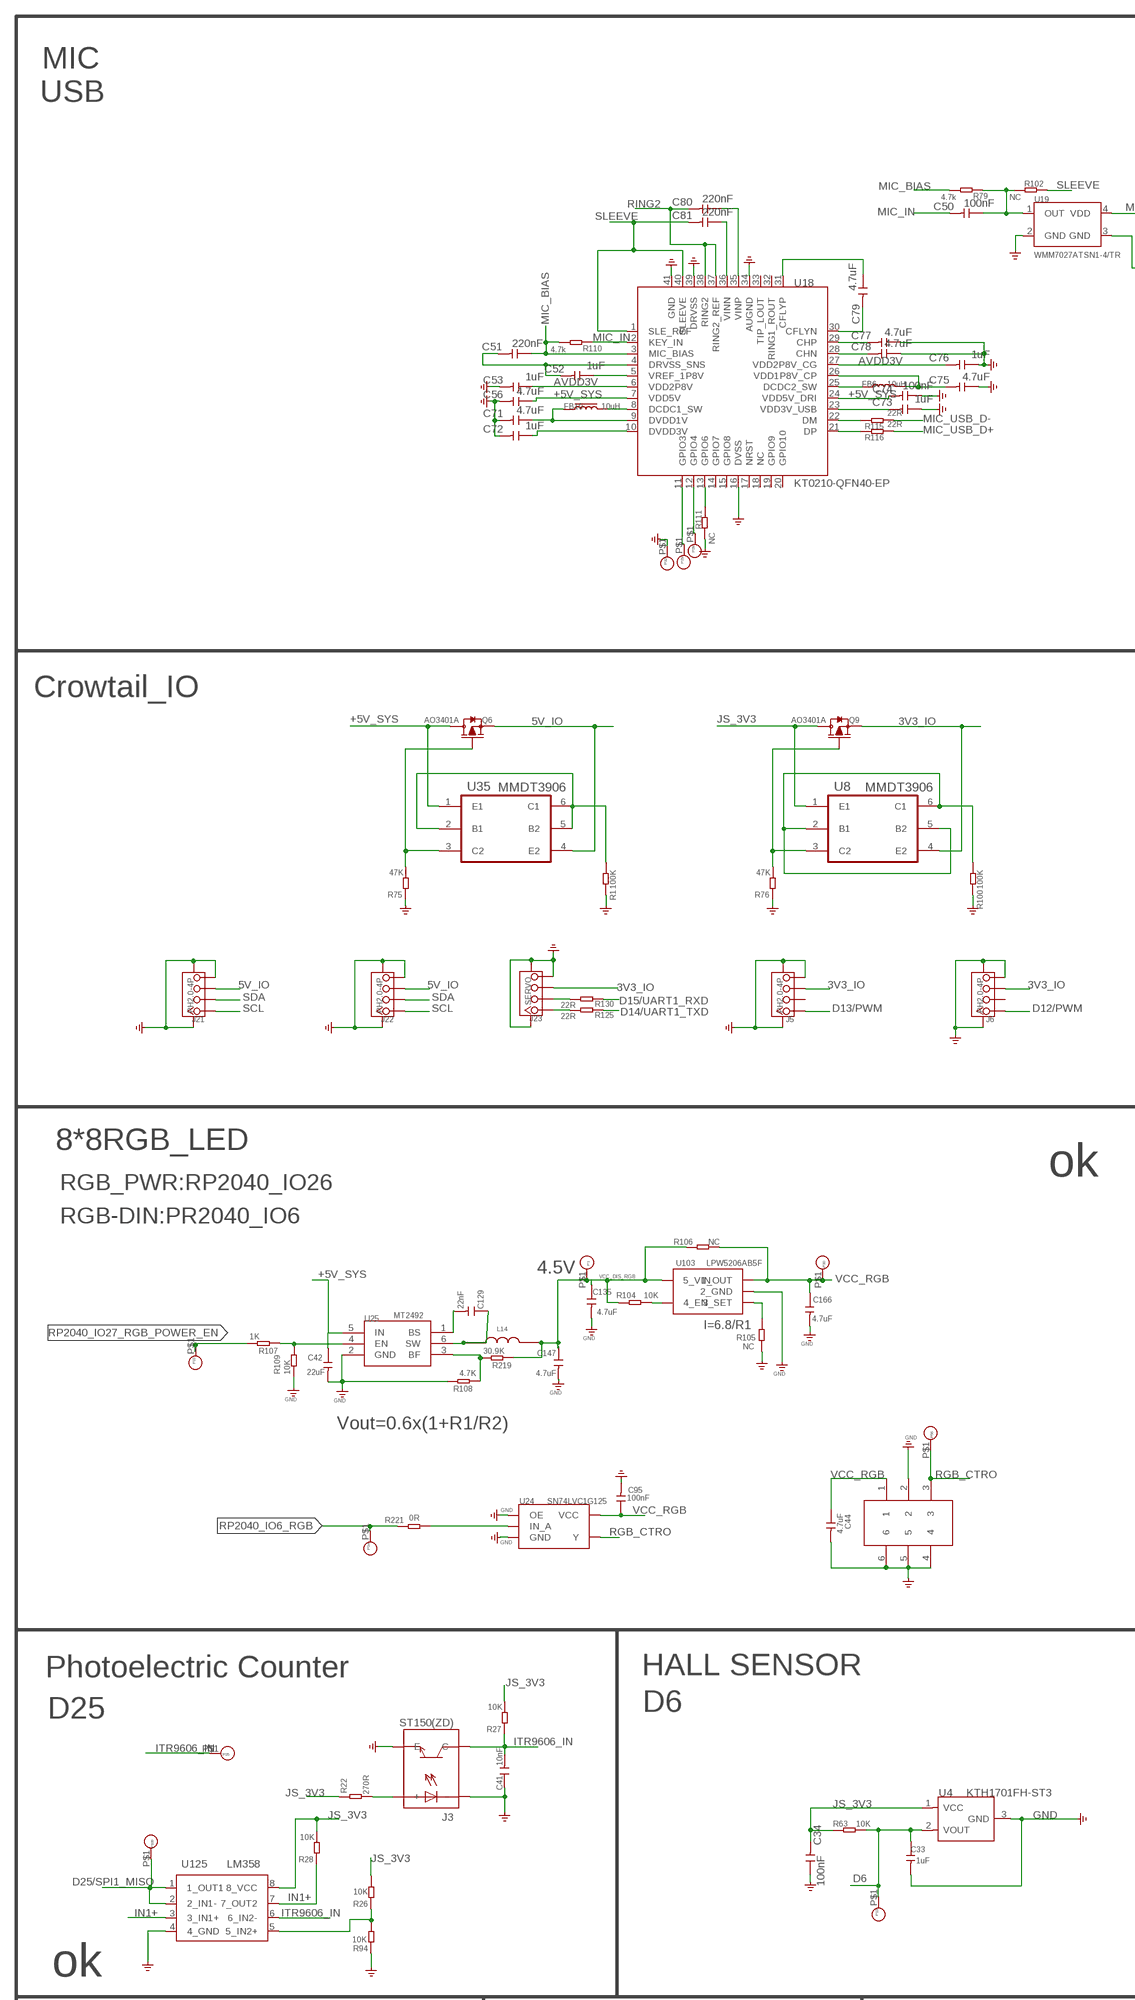
[diagram p3: schematic, sheet 2, part 1 of 4]
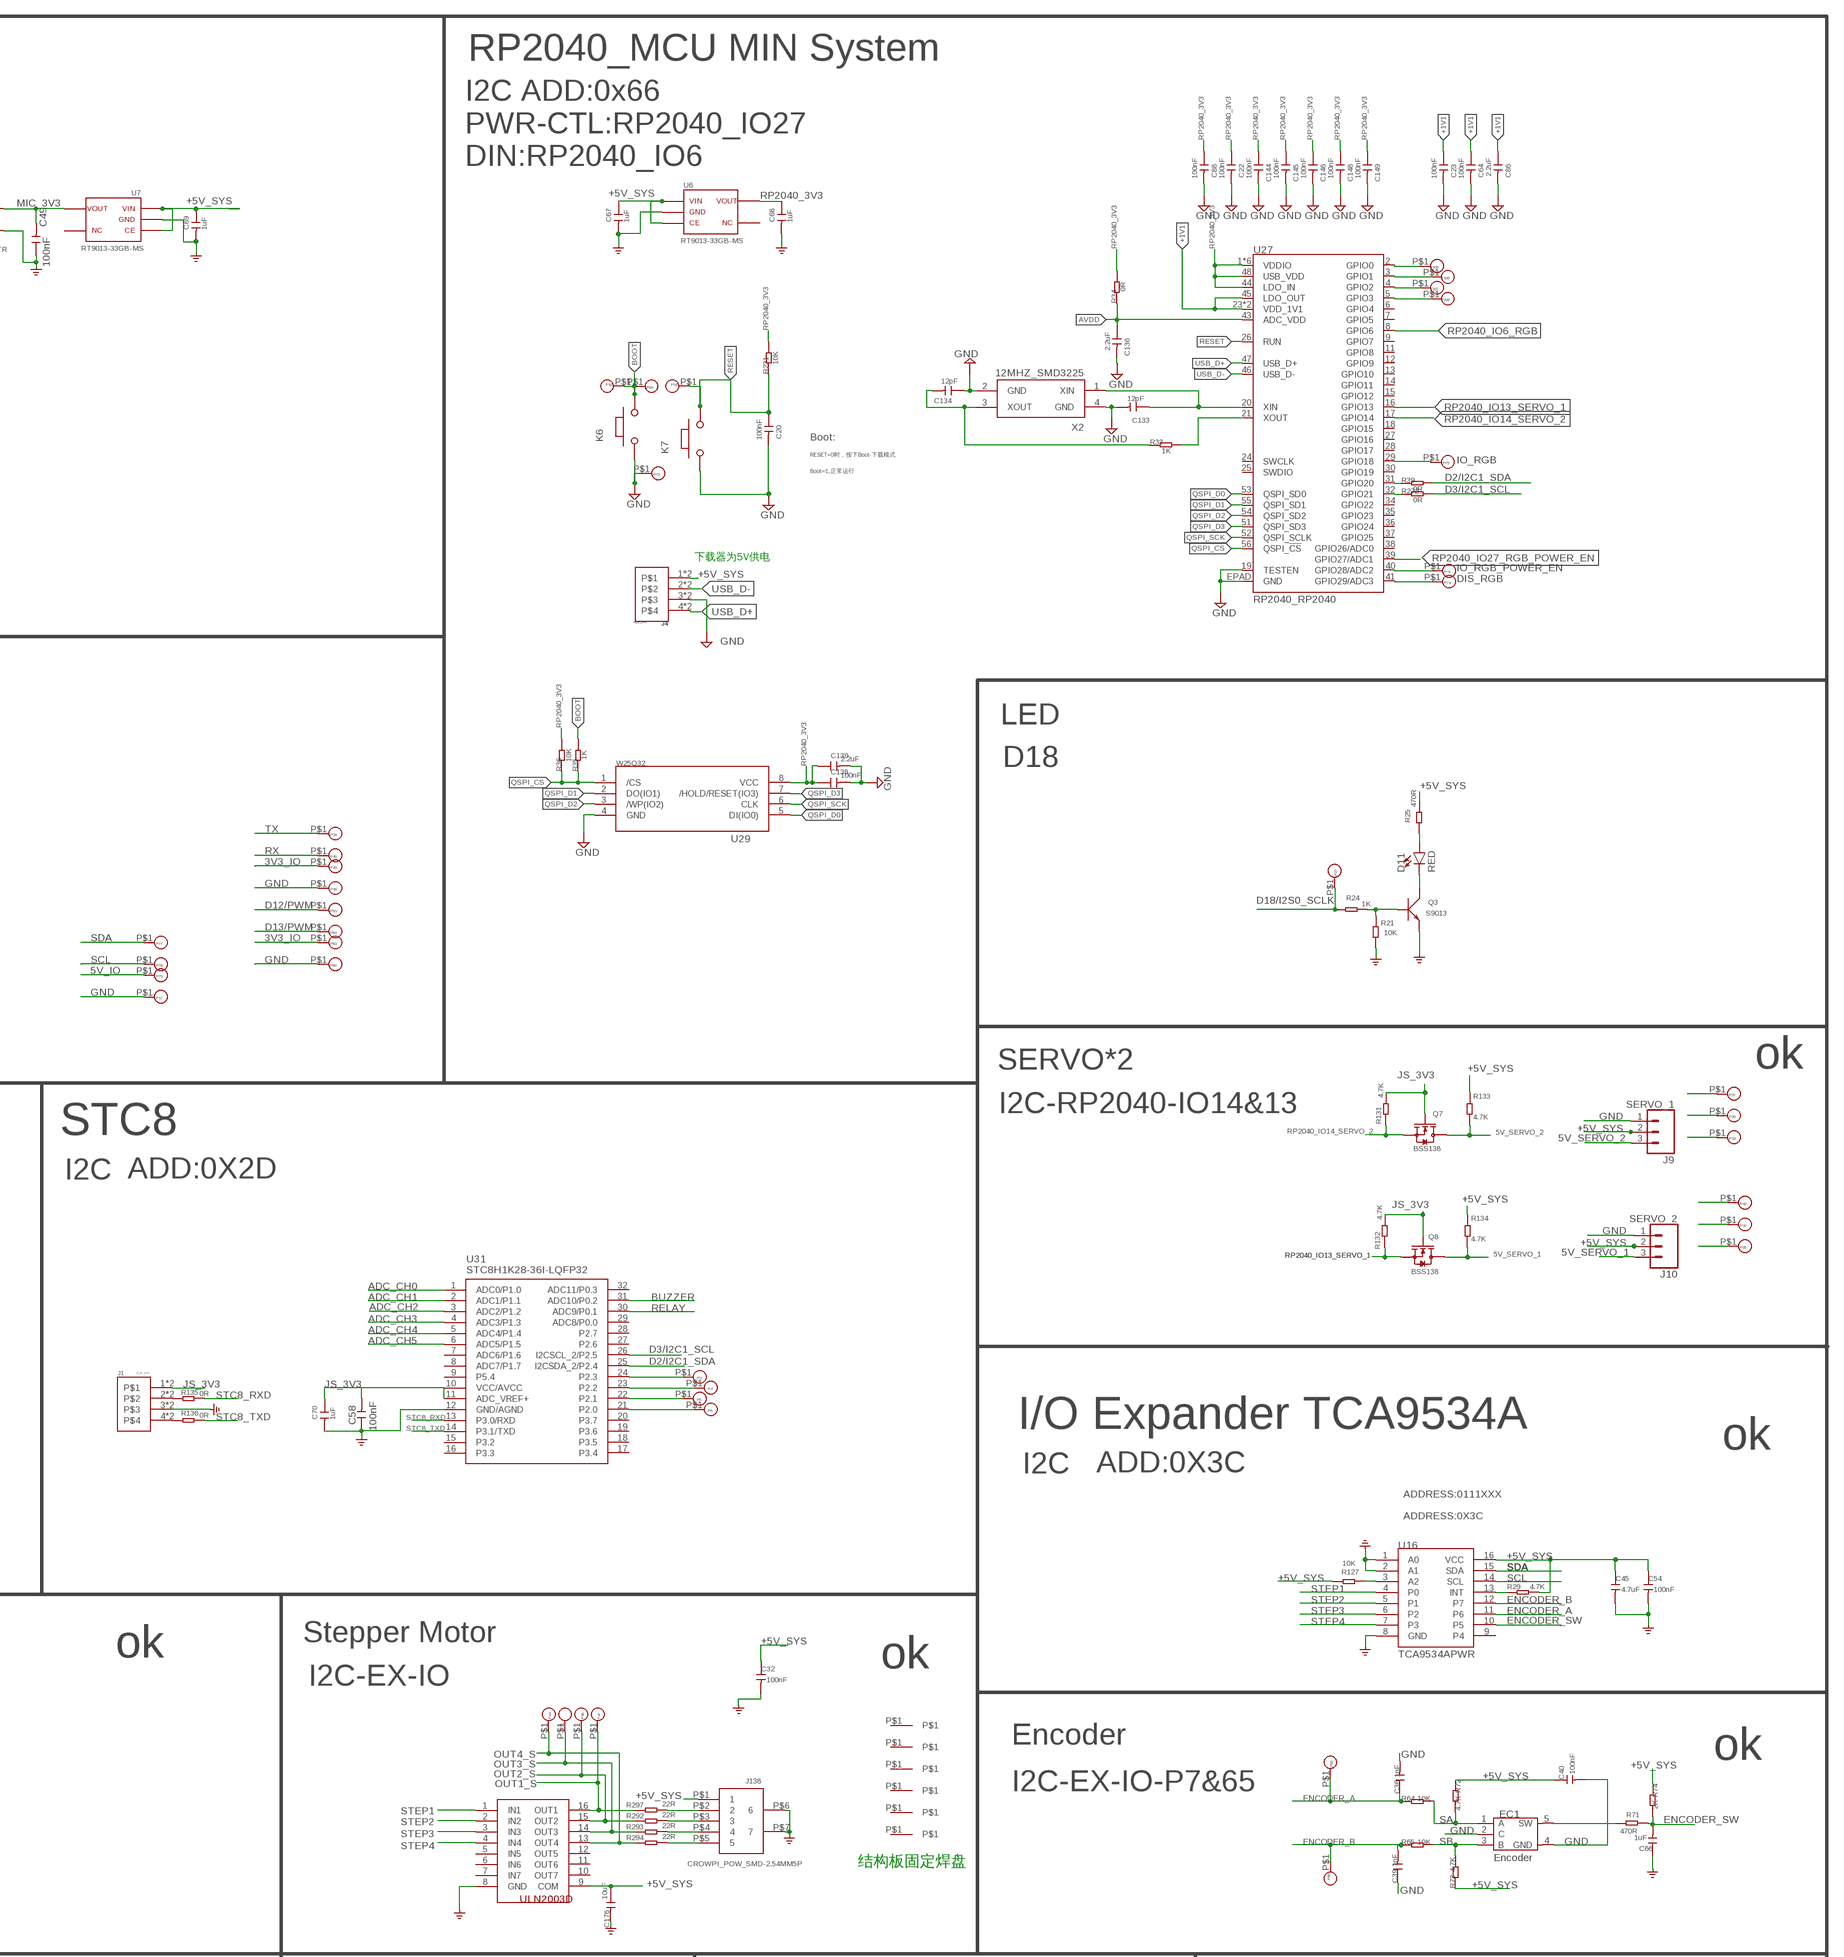
[diagram p4: schematic, sheet 2, part 2 of 4]
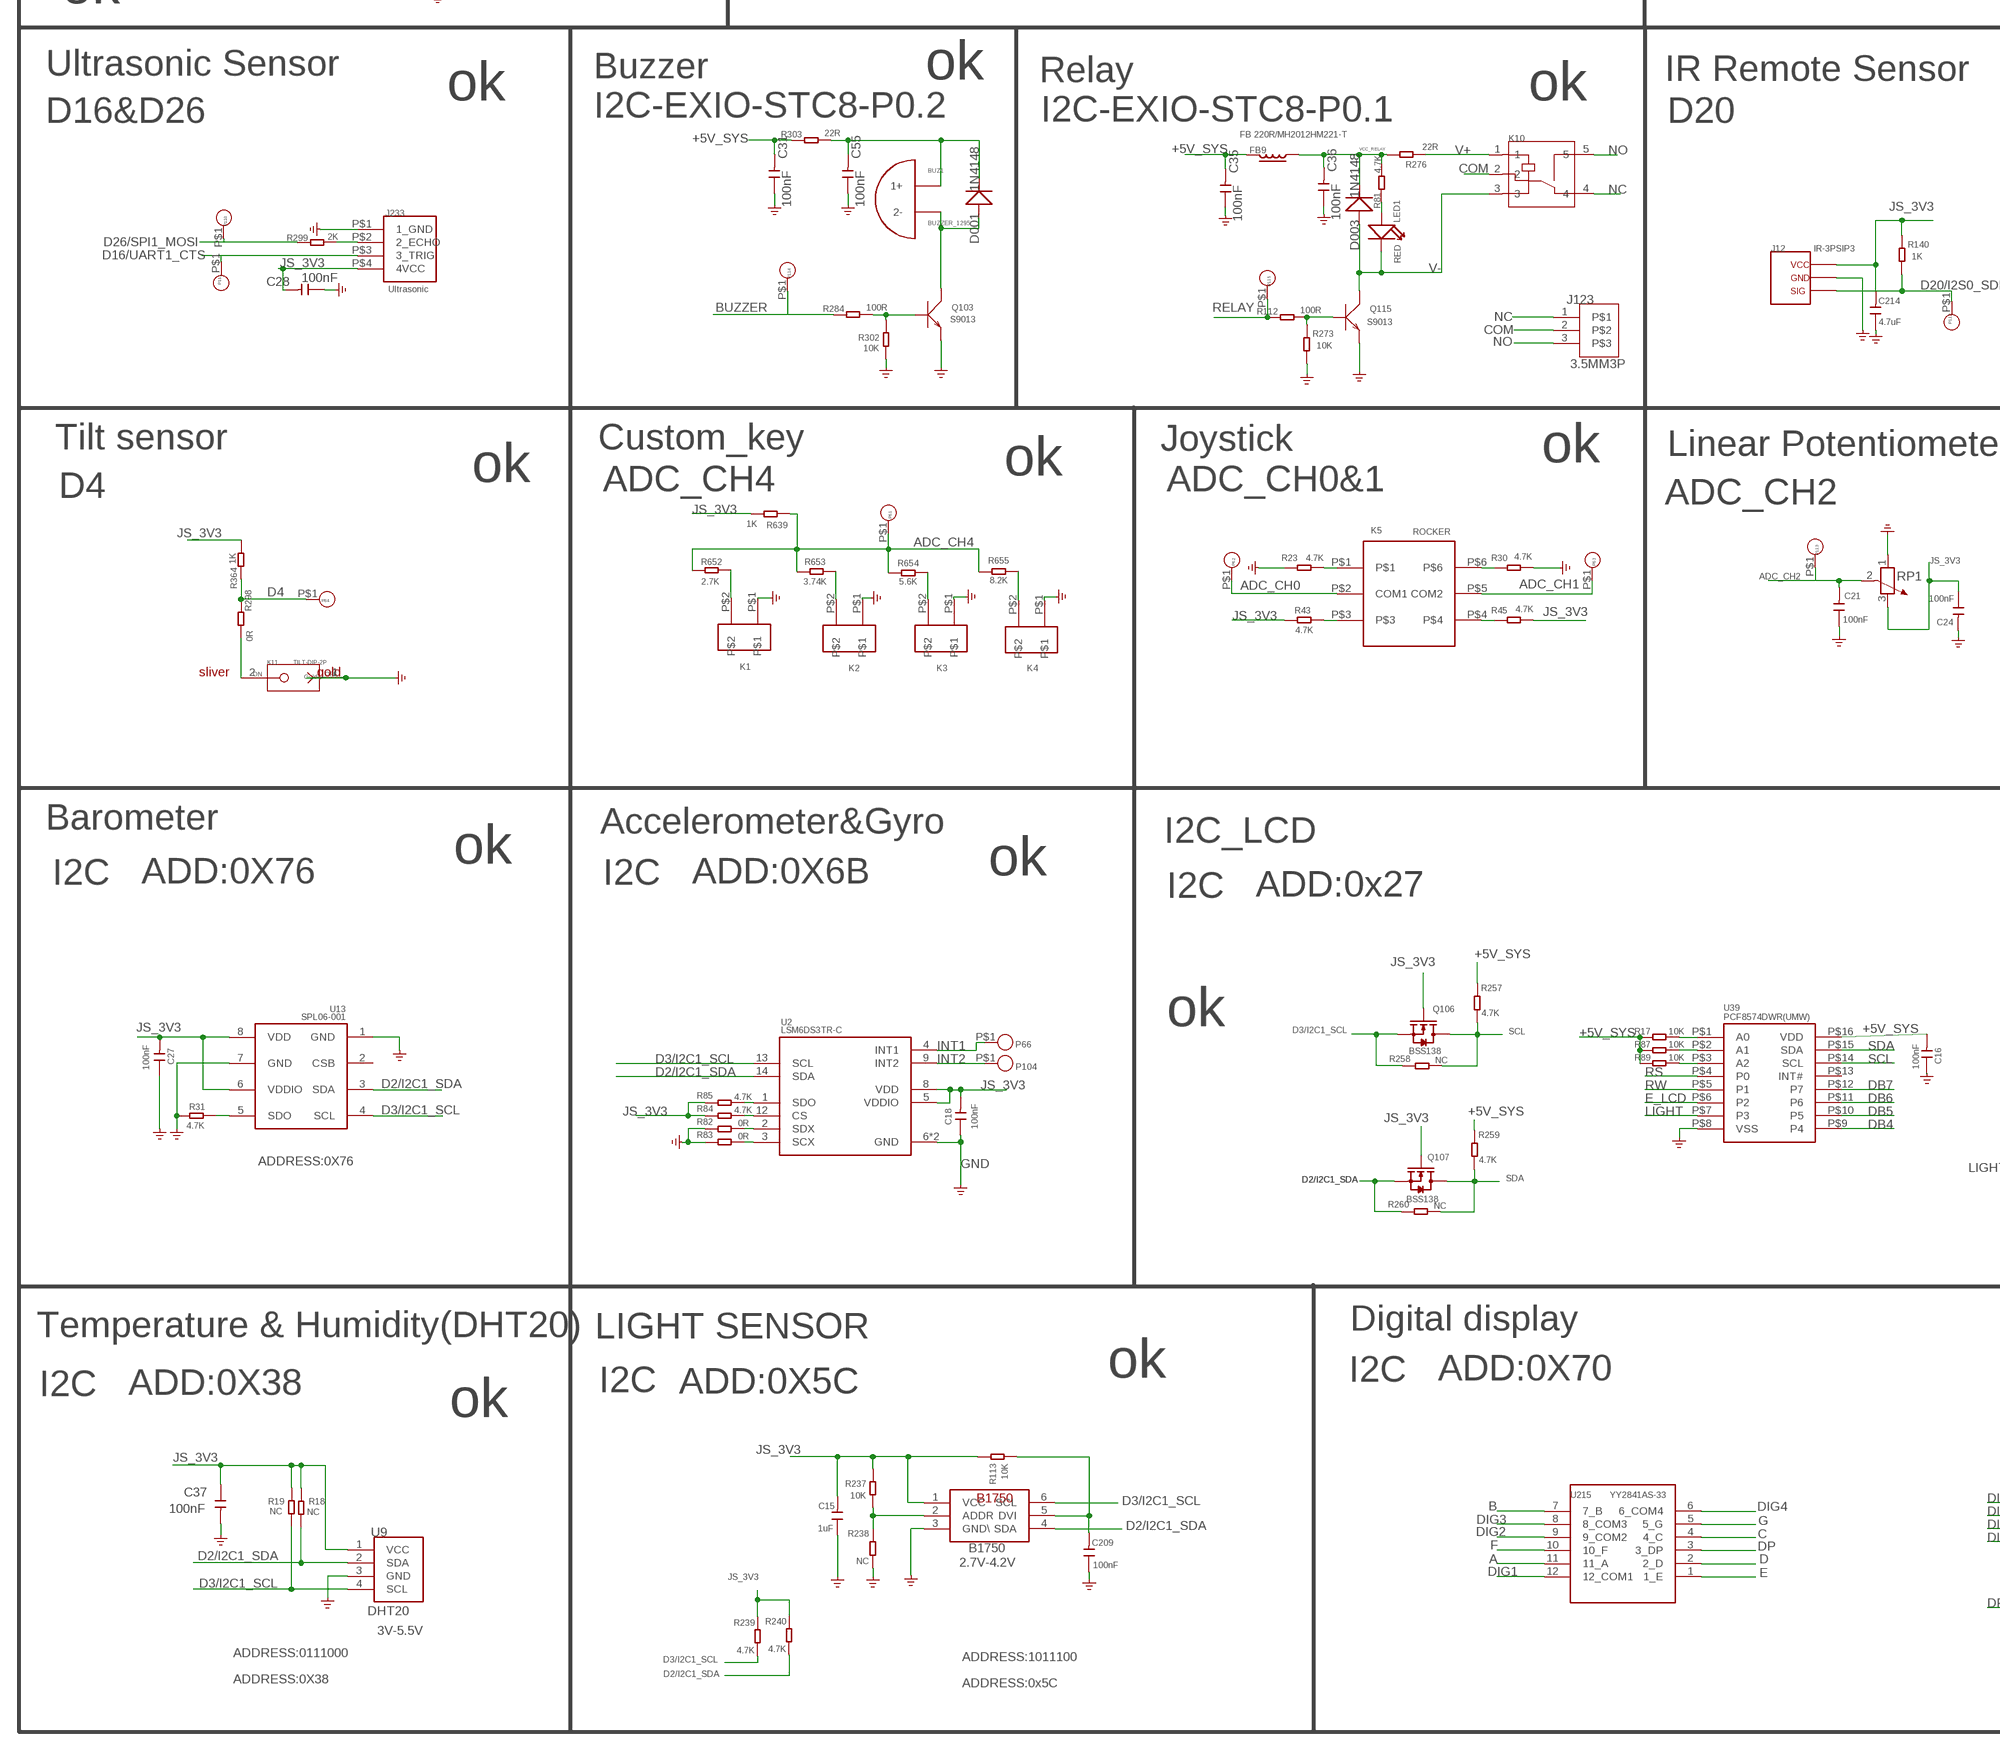
[diagram p5: schematic, sheet 2, part 3 of 4]
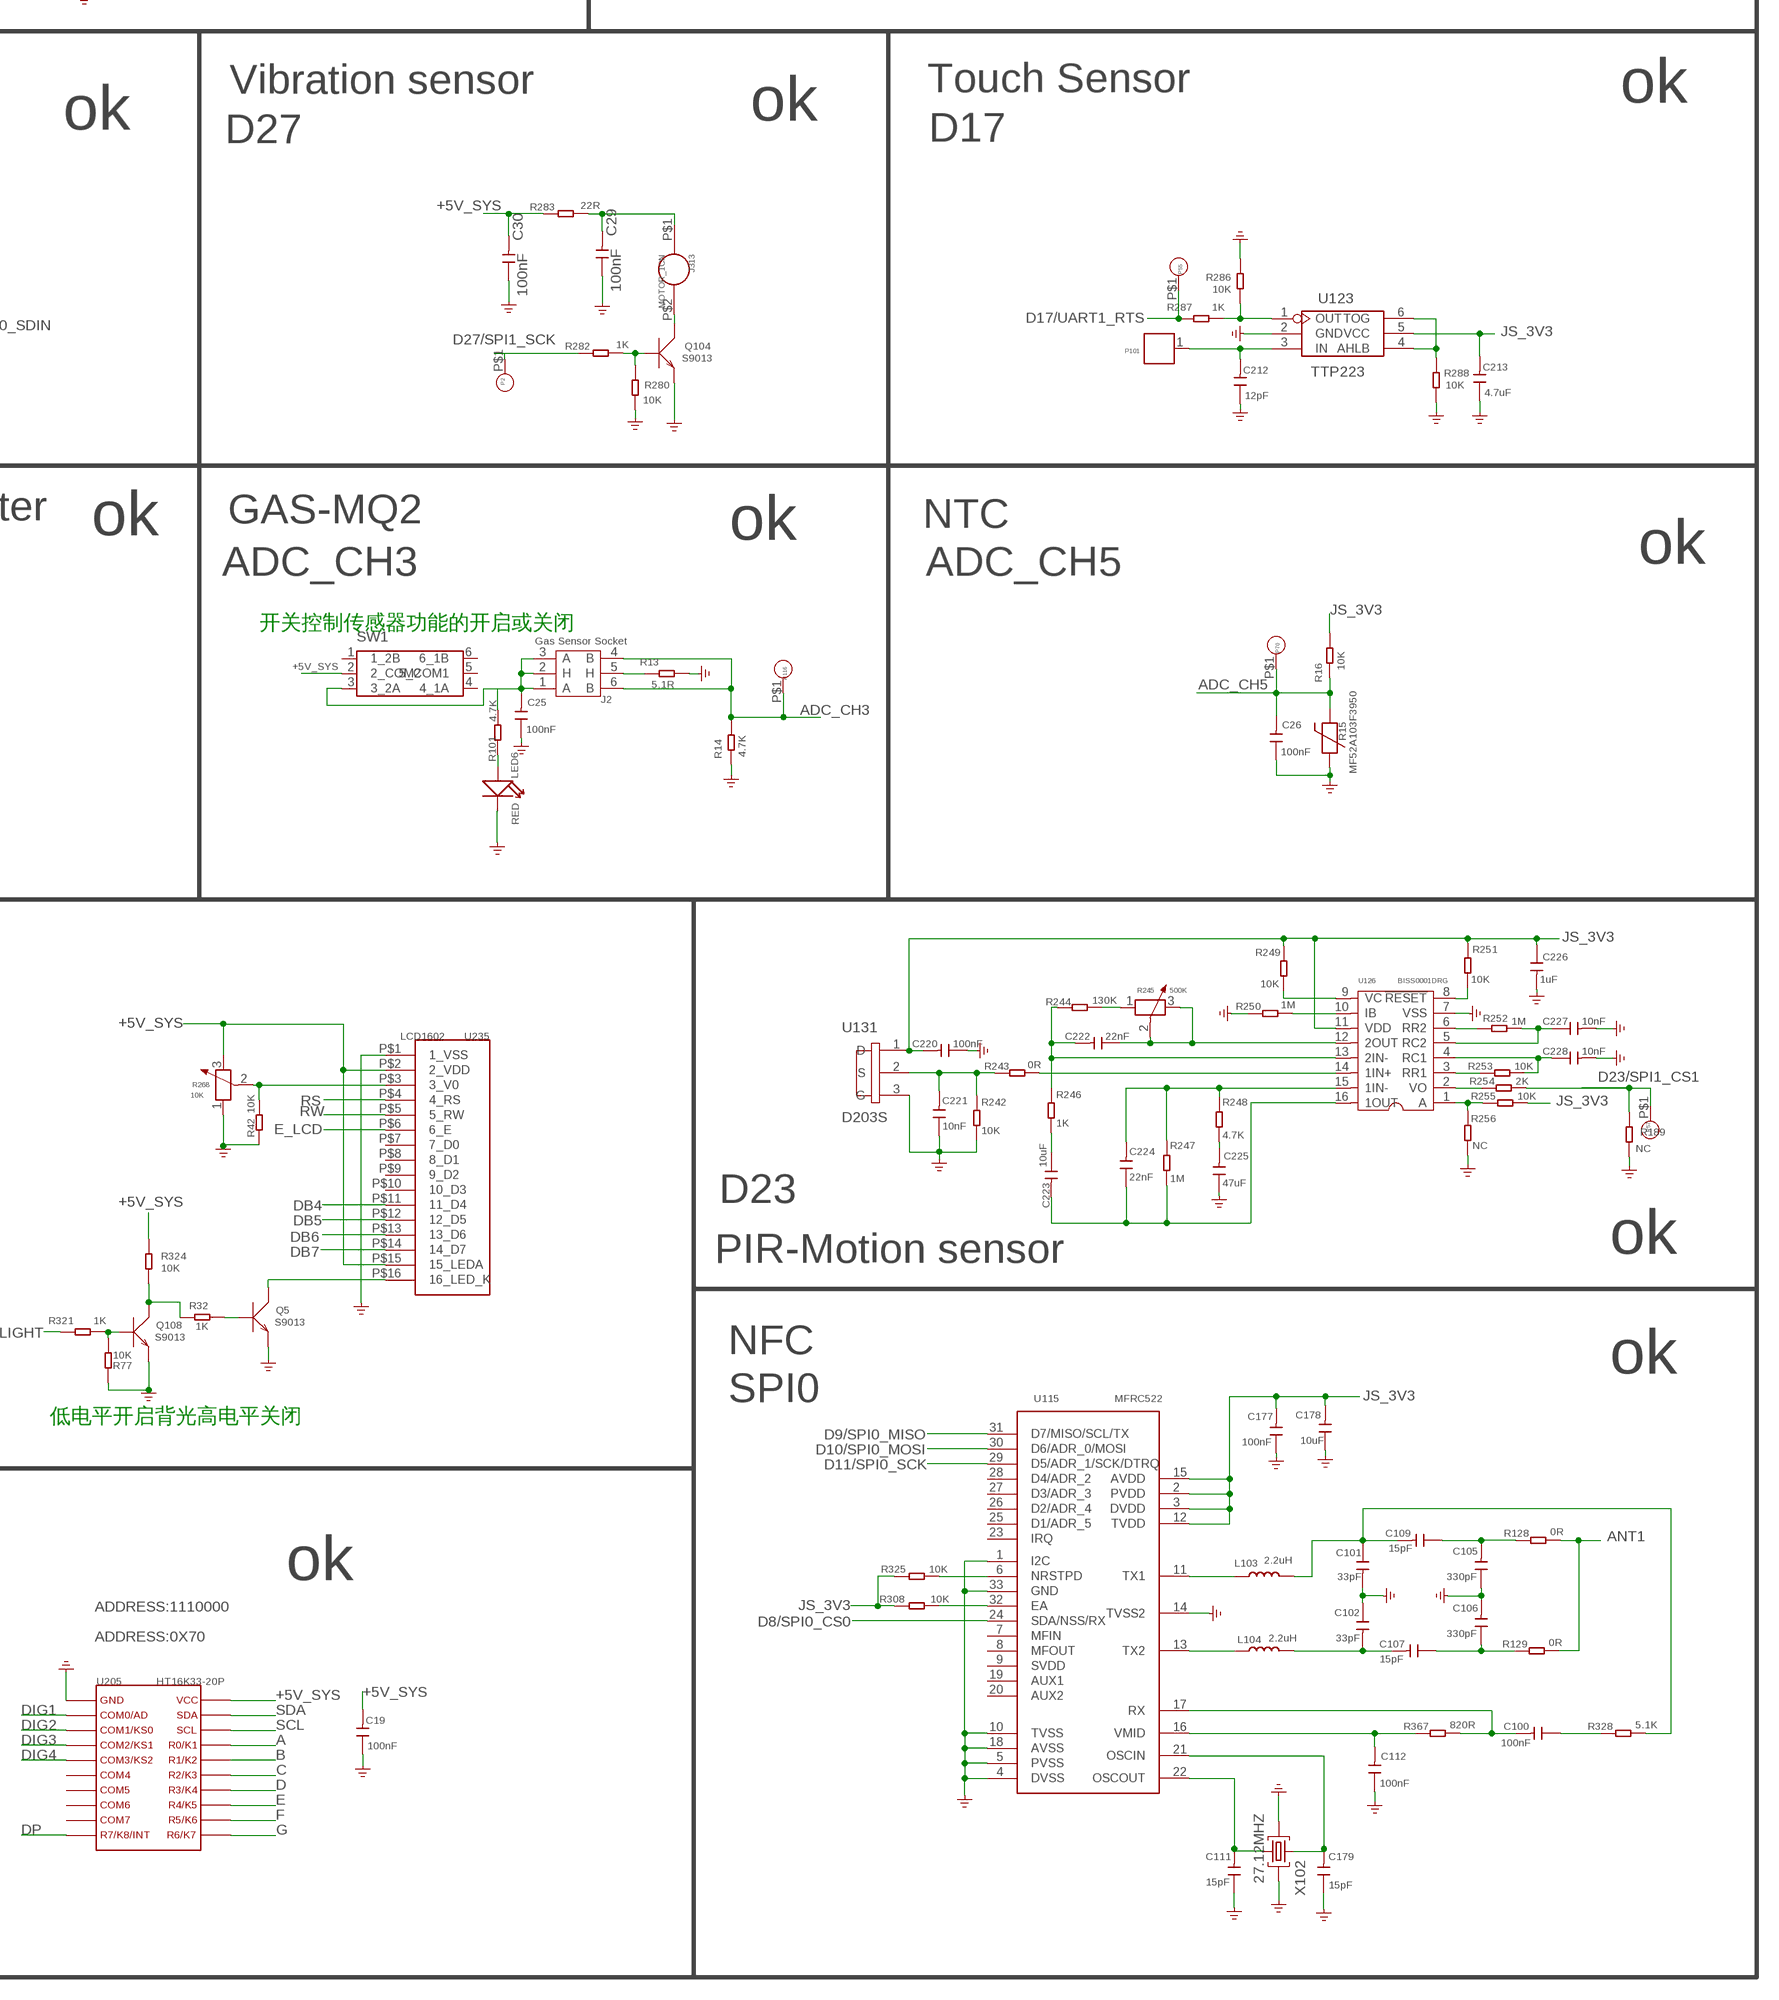
[diagram p6: schematic, sheet 2, part 4 of 4]

### Parts
BUZ1  BUZZER_1295  BUZZER  [BUZZER_0955_DIP]
C15  1uF  CAPC0603  [C0603]
C16  100nF  CAPC0603  [C0603]
C18  100nF  CAPC0603  [C0603]
C19  100nF  CAPC0603  [C0603]
C20  100nF  CAPC0603  [C0603]
C21  100nF  CAPC0603  [C0603]
C22  100nF  CAPC0603  [C0603]
C23  100nF  CAPC0603  [C0603]
C24  100nF  CAPC0603  [C0603]
C25  100nF  CAPC0603  [C0603]
C26  100nF  CAPC0603  [C0603]
C27  100nF  CAPC0603  [C0603]
C28  100nF  CAPC0603  [C0603]
C29  100nF  CAPC0603  [C0603]
C30  100nF  CAPC0603  [C0603]
C31  100nF  CAPC0603  [C0603]
C32  100nF  CAPC0603  [C0603]
C33  1uF  CAPC0603  [C0603]
C34  100nF  CAPC0603  [C0603]
C35  100nF  CAPC0603  [C0603]
C36  100nF  CAPC0603  [C0603]
C37  100nF  CAPC0603  [C0603]
C38  1nF  CAPC0603  [C0603]
C39  1nF  CAPC0603  [C0603]
C40  100nF  CAPC0603  [C0603]
C41  10nF  CAPC0603  [C0603]
C42  22uF  CAPC0805  [C0805]
C44  4.7uF  CAPC0603  [C0603]
C45  4.7uF  CAPC0603  [C0603]
C49  100nF  C-0603  [C0603]
C50  100nF  C-0603  [C0603]
C51  220nF  C-0603  [C0603]
C52  1uF  C-0603  [C0603]
C53  1uF  C-0603  [C0603]
C54  100nF  CAPC0603  [C0603]
C55  100nF  CAPC0603  [C0603]
C56  4.7uF  C-0603  [C0603]
C58  100nF  CAPC0603  [C0603]
C64  100nF  CAPC0603  [C0603]
C66  1uF  CAPC0603  [C0603]
C67  1uF  CAPC0603  [C0603]
C68  1uF  CAPC0603  [C0603]
C69  1uF  CAPC0603  [C0603]
C70  1uF  CAPC0603  [C0603]
C71  4.7uF  C-0603  [C0603]
C72  1uF  C-0603  [C0603]
C73  1uF  C-0603  [C0603]
C74  100nF  C-0603  [C0603]
C75  4.7uF  C-0603  [C0603]
C76  1uF  C-0603  [C0603]
C77  4.7uF  C-0603  [C0603]
C78  4.7uF  C-0603  [C0603]
C79  4.7uF  C-0603  [C0603]
C80  220nF  C-0603  [C0603]
C81  220nF  C-0603  [C0603]
C86  2.2uF  CAPC0603  [C0603]
C88  100nF  CAPC0603  [C0603]
C95  100nF  CAPC0603  [C0603]
C100  100nF  CAPC0603  [C0603]
C101  33pF  CAPC0603  [C0603]
C102  33pF  CAPC0603  [C0603]
C105  330pF  CAPC0603  [C0603]
C106  330pF  CAPC0603  [C0603]
C107  15pF  CAPC0603  [C0603]
C109  15pF  CAPC0603  [C0603]
C111  15pF  CAPC0603  [C0603]
C112  100nF  CAPC0603  [C0603]
C129  22nF  CAPC0603  [C0603]
C133  12pF  CAPC0603  [C0603]
C134  12pF  CAPC0603  [C0603]
C135  4.7uF  CAPC0603  [C0603]
C136  2.2uF  CAPC0603  [C0603]
C138  100nF  CAPC0603  [C0603]
C139  2.2uF  CAPC0603  [C0603]
C144  100nF  CAPC0603  [C0603]
C145  100nF  CAPC0603  [C0603]
C146  100nF  CAPC0603  [C0603]
C147  4.7uF  CAPC0603  [C0603]
C148  100nF  CAPC0603  [C0603]
C149  100nF  CAPC0603  [C0603]
C166  4.7uF  CAPC0603  [C0603]
C176  10uF  CAPC0805  [C0805]
C177  100nF  CAPC0603  [C0603]
C178  10uF  CAPC0805  [C0805]
C179  15pF  CAPC0603  [C0603]
C209  100nF  CAPC0603  [C0603]
C212  12pF  CAPC0603  [C0603]
C213  4.7uF  CAPC0603  [C0603]
C214  4.7uF  CAPC0603  [C0603]
C220  100nF  CAPC0603  [C0603]
C221  10nF  CAPC0603  [C0603]
C222  22nF  CAPC0603  [C0603]
C223  10uF  CAPC0805  [C0805]
C224  22nF  CAPC0603  [C0603]
C225  47uF  CAPC0805  [C0805]
C226  1uF  CAPC0603  [C0603]
C227  10nF  CAPC0603  [C0603]
C228  10nF  CAPC0603  [C0603]
D001  1N4148  DIODE1206  [D_SOD123]
D003  1N4148  DIODE1206  [D_SOD123]
D11  RED  LED  [LED-8MM]
EC1  Encoder  ROTARY-ENCODE-5P  [5P-13.75X11.7X6.5H]
FB6  10uH  L0603  [L0603]
FB9  FB 220R/MH2012HM221-T  FBL0805  [L0805]
FB10  10uH  FBL0603  [L0603]
J1  H_22_2.54  [P4_2.54*4_VIA]
J2  Gas Sensor Socket  MQ-SOCKET  [MQ2]
J3  ST150(ZD)  KLH-512L  [2*2P-IR928]
J4  H_22_2.54  [P4_2.54*4_VIA]
J5  PH2.0-4P  TWIG-4P-2.0-SMD-FEMALE-REINFORCE'DD'  [4P-SMD-2.0]
J6  PH2.0-4P  TWIG-4P-2.0-SMD-FEMALE-REINFORCE'DD'  [4P-SMD-2.0]
J9  SERVO_1  CONN_03  [1X03]
J10  SERVO_2  CONN_03  [1X03]
J12  IR-3PSIP3  [VS1838B-SIP3]
J14  RGB6464AMD  [RGB64*64AMD]
J21  PH2.0-4P  TWIG-4P-2.0-SMD-FEMALE-REINFORCE'DD'  [4P-SMD-2.0]
J22  PH2.0-4P  TWIG-4P-2.0-SMD-FEMALE-REINFORCE'DD'  [4P-SMD-2.0]
J23  SERVO  TWIG-4P-2.0-SMD-FEMALE-REINFORCE'DD'  [4P-SMD-2.0]
J123  3.5MM3P  [3.5MM*3P]
J138  CROWPI_POW_SMD-2.54MM5P  [CROWPI_POW_SMD-5P*2.54]
J233  Ultrasonic  ULTRA  [ULTRA]
J313  MOTOR_1CN  [MOTOR_1CM]
K1  BUTTON_2P  [BUTTON_2P]
K2  BUTTON_2P  [BUTTON_2P]
K3  BUTTON_2P  [BUTTON_2P]
K4  BUTTON_2P  [BUTTON_2P]
K5  ROCKER  [ROCKER]
K6  BUTTON  PB157  [157SW]
K7  BUTTON  PB157  [157SW]
K10  RELAY-SRD  [REY5-6-19.1X15.5X15.3MM]
K11  TILT-DIP-2P  [TILT]
L14  CD32_950MA  [CD32]
L103  2.2uH  L0805  [0805@1]
L104  2.2uH  L0805  [0805@1]
LED1  RED  DISCRETE_LED0603  [DISCRETE_LED-0603]
LED6  RED  DISCRETE_LED0603  [DISCRETE_LED-0603]
P1  PADPAD-1.0MM  [PAD-1.0MM]
P2  PADPAD-1.0MM  [PAD-1.0MM]
P3  PADPAD-1.0MM  [PAD-1.0MM]
P4  PADPAD-1.0MM  [PAD-1.0MM]
P5  PADPAD-1.0MM  [PAD-1.0MM]
P6  PADPAD-1.0MM  [PAD-1.0MM]
P10  PADPAD-1.0MM  [PAD-1.0MM]
P13  PADPAD-1.0MM  [PAD-1.0MM]
P17  PADPAD-1.0MM  [PAD-1.0MM]
P25  PADPAD-1.0MM  [PAD-1.0MM]
P26  PADPAD-1.0MM  [PAD-1.0MM]
P27  PADPAD-1.0MM  [PAD-1.0MM]
P28  PADPAD-1.0MM  [PAD-1.0MM]
P29  PADPAD-1.0MM  [PAD-1.0MM]
P30  PADPAD-1.0MM  [PAD-1.0MM]
P31  PADPAD-1.0MM  [PAD-1.0MM]
P32  PADPAD-1.0MM  [PAD-1.0MM]
P33  PADPAD-1.0MM  [PAD-1.0MM]
P34  PADPAD-1.0MM  [PAD-1.0MM]
P35  PADPAD-1.0MM  [PAD-1.0MM]
P36  PADPAD-1.0MM  [PAD-1.0MM]
P37  PADPAD-1.0MM  [PAD-1.0MM]
P38  PADPAD-1.0MM  [PAD-1.0MM]
P39  PADPAD-1.0MM  [PAD-1.0MM]
P40  PADPAD-1.0MM  [PAD-1.0MM]
P41  PADPAD-1.0MM  [PAD-1.0MM]
P42  PADPAD-1.0MM  [PAD-1.0MM]
P43  PADPAD-1.0MM  [PAD-1.0MM]
P44  PADPAD-1.0MM  [PAD-1.0MM]
P45  PADPAD-1.0MM  [PAD-1.0MM]
P46  PADPAD-1.0MM  [PAD-1.0MM]
P47  PADPAD-1.0MM  [PAD-1.0MM]
P55  PADPAD-1.0MM  [PAD-1.0MM]
P56  PADPAD-1.0MM  [PAD-1.0MM]
P57  PADPAD-1.0MM  [PAD-1.0MM]
P59  PADPAD-1.0MM  [PAD-1.0MM]
P60  PADPAD-1.0MM  [PAD-1.0MM]
P61  PADPAD-1.0MM  [PAD-1.0MM]
P62  PADPAD-1.0MM  [PAD-1.0MM]
P63  PADPAD-1.0MM  [PAD-1.0MM]
P66  TEST_PAD  TEST_PADPAD-1.0MM  [TEST_PAD-1.0MM]
P69  PADPAD-1.0MM  [PAD-1.0MM]
P70  PADPAD-1.0MM  [PAD-1.0MM]
P73  PADPAD-1.0MM  [PAD-1.0MM]
P74  PADPAD-1.0MM  [PAD-1.0MM]
P75  IO_RGB  PADPAD-1.0MM  [PAD-1.0MM]
P76  PADPAD-1.0MM  [PAD-1.0MM]
P77  PADPAD-1.0MM  [PAD-1.0MM]
P78  PADPAD-1.0MM  [PAD-1.0MM]
P79  PADPAD-1.0MM  [PAD-1.0MM]
P80  PADPAD-1.0MM  [PAD-1.0MM]
P81  PADPAD-1.0MM  [PAD-1.0MM]
P82  PADPAD-1.0MM  [PAD-1.0MM]
P83  PADPAD-1.0MM  [PAD-1.0MM]
P84  PADPAD-1.0MM  [PAD-1.0MM]
P101  KEY  PAD'D450MIL'  [1P-D450]
P104  TEST_PAD  TEST_PADPAD-1.0MM  [TEST_PAD-1.0MM]
P105  IO_RGB  PADPAD-1.0MM  [PAD-1.0MM]
P106  IO_RGB  PADPAD-1.0MM  [PAD-1.0MM]
P107  IO_RGB  PADPAD-1.0MM  [PAD-1.0MM]
P108  IO_RGB  PADPAD-1.0MM  [PAD-1.0MM]
P109  PADPAD-1.0MM  [PAD-1.0MM]
P110  PADPAD-1.0MM  [PAD-1.0MM]
P111  PADPAD-1.0MM  [PAD-1.0MM]
P112  PADPAD-1.0MM  [PAD-1.0MM]
P113  PADPAD-1.0MM  [PAD-1.0MM]
P114  PADPAD-1.0MM  [PAD-1.0MM]
P115  PADPAD-1.0MM  [PAD-1.0MM]
P116  PADPAD-1.0MM  [PAD-1.0MM]
Q3  S9013  TRANSISTOR-NPN-SOT23  [SOT23@1]
Q5  S9013  TRANSISTOR-NPN-SOT23  [SOT23@1]
Q6  AO3401A  MOSFET-PSOT23  [PMOS_SOT23]
Q7  BSS138  MOSFET-N'SOT23'  [SOT23]
Q8  BSS138  MOSFET-N'SOT23'  [SOT23]
Q9  AO3401A  MOSFET-PSOT23  [PMOS_SOT23]
Q103  S9013  TRANSISTOR-NPN-SOT23  [SOT23@1]
Q104  S9013  TRANSISTOR-NPN-SOT23  [SOT23@1]
Q106  BSS138  MOSFET-N'SOT23'  [SOT23]
Q107  BSS138  MOSFET-N'SOT23'  [SOT23]
Q108  S9013  TRANSISTOR-NPN-SOT23  [SOT23@1]
Q115  S9013  TRANSISTOR-NPN-SOT23  [SOT23@1]
R1  100K  RESR0603  [R0603]
R13  5.1R  RESR0603  [R0603]
R14  4.7K  RESR0603  [R0603]
R15  MF52A103F3950  [RES-TH_L2.5-W2.5-P1.70-D0.3]
R16  10K  RESR0603  [R0603]
R17  10K  RESR0603  [R0603]
R18  NC  RESR0603  [R0603]
R19  NC  RESR0603  [R0603]
R21  10K  RESR0603  [R0603]
R22  270R  RESR0603  [R0603]
R23  4.7K  RESR0603  [R0603]
R24  1K  RESR0603  [R0603]
R25  470R  RESR0603  [R0603]
R26  10K  RESR0603  [R0603]
R27  10K  RESR0603  [R0603]
R28  10K  RESR0603  [R0603]
R29  4.7K  RESR0603  [R0603]
R30  4.7K  RESR0603  [R0603]
R31  4.7K  RESR0603  [R0603]
R32  1K  RESR0603  [R0603]
R33  1K  RESR0603  [R0603]
R34  0R  RESR0603  [R0603]
R35  1K  RESR0603  [R0603]
R36  10K  RESR0603  [R0603]
R39  0R  RESR0603  [R0603]
R42  10K  RESR0603  [R0603]
R43  4.7K  RESR0603  [R0603]
R45  4.7K  RESR0603  [R0603]
R63  10K  RESR0603  [R0603]
R64  10K  RESR0603  [R0603]
R65  10K  RESR0603  [R0603]
R71  470R  RESR0603  [R0603]
R72  4.7K  RESR0603  [R0603]
R73  4.7K  RESR0603  [R0603]
R74  2K  RESR0603  [R0603]
R75  47K  RESR0603  [R0603]
R76  47K  RESR0603  [R0603]
R77  10K  RESR0603  [R0603]
R79  4.7k  R0603  [R0603]
R81  4.7K  RESR0603  [R0603]
R82  0R  RESR0603  [R0603]
R83  0R  RESR0603  [R0603]
R84  4.7K  RESR0603  [R0603]
R85  4.7K  RESR0603  [R0603]
R87  10K  RESR0603  [R0603]
R89  10K  RESR0603  [R0603]
R94  10K  RESR0603  [R0603]
R100  100K  RESR0603  [R0603]
R101  4.7K  RESR0603  [R0603]
R102  NC  R0603  [R0603]
R104  10K  RESR0603  [R0603]
R105  NC  RESR0603  [R0603]
R106  NC  RESR0603  [R0603]
R107  1K  RESR0603  [R0603]
R108  4.7K  RESR0603  [R0603]
R109  10K  RESR0603  [R0603]
R110  4.7k  R0603  [R0603]
R111  NC  R0603  [R0603]
R112  100R  RESR0603  [R0603]
R113  10K  RESR0603  [R0603]
R115  22R  R0603  [R0603]
R116  22R  R0603  [R0603]
R125  22R  RESR0603  [R0603]
R127  10K  RESR0603  [R0603]
R128  0R  RESR0603  [R0603]
R129  0R  RESR0603  [R0603]
R130  22R  RESR0603  [R0603]
R131  4.7K  RESR0603  [R0603]
R132  4.7K  RESR0603  [R0603]
R133  4.7K  RESR0603  [R0603]
R134  4.7K  RESR0603  [R0603]
R135  0R  RESR0603  [R0603]
R136  0R  RESR0603  [R0603]
R140  1K  RESR0603  [R0603]
R189  NC  RESR0603  [R0603]
R219  30.9K  RESR0603  [R0603]
R221  0R  RESR0603  [R0603]
R231  10K  RESR0603  [R0603]
R237  10K  RESR0603  [R0603]
R238  NC  RESR0603  [R0603]
R239  4.7K  RESR0603  [R0603]
R240  4.7K  RESR0603  [R0603]
R242  10K  RESR0603  [R0603]
R243  0R  RESR0603  [R0603]
R244  130K  RESR0603  [R0603]
R245  500K  R-POTENTIOMETER-SMD  [3P-SMD-SQUA-3.6X3.3]
R246  1K  RESR0603  [R0603]
R247  1M  RESR0603  [R0603]
R248  4.7K  RESR0603  [R0603]
R249  10K  RESR0603  [R0603]
R250  1M  RESR0603  [R0603]
R251  10K  RESR0603  [R0603]
R252  1M  RESR0603  [R0603]
R253  10K  RESR0603  [R0603]
R254  2K  RESR0603  [R0603]
R255  10K  RESR0603  [R0603]
R256  NC  RESR0603  [R0603]
R257  4.7K  RESR0603  [R0603]
R258  NC  RESR0603  [R0603]
R259  4.7K  RESR0603  [R0603]
R260  NC  RESR0603  [R0603]
R268  10K  R-POTENTIOMETER-SMD  [3P-SMD-SQUA-3.6X3.3]
R272  0R  RESR0603  [R0603]
R273  10K  RESR0603  [R0603]
R276  22R  RESR0603  [R0603]
R280  10K  RESR0603  [R0603]
R282  1K  RESR0603  [R0603]
R283  22R  RESR0603  [R0603]
R284  100R  RESR0603  [R0603]
R286  10K  RESR0603  [R0603]
R287  1K  RESR0603  [R0603]
R288  10K  RESR0603  [R0603]
R292  22R  RESR0603  [R0603]
R293  22R  RESR0603  [R0603]
R294  22R  RESR0603  [R0603]
R297  22R  RESR0603  [R0603]
R298  0R  RESR0603  [R0603]
R299  2K  RESR0603  [R0603]
R302  10K  RESR0603  [R0603]
R303  22R  RESR0603  [R0603]
R308  10K  RESR0603  [R0603]
R321  1K  RESR0603  [R0603]
R324  10K  RESR0603  [R0603]
R325  10K  RESR0603  [R0603]
R328  5.1K  RESR0603  [R0603]
R364  1K  RESR0603  [R0603]
R367  820R  RESR0603  [R0603]
R639  1K  RESR0603  [R0603]
R652  2.7K  RESR0603  [R0603]
R653  3.74K  RESR0603  [R0603]
R654  5.6K  RESR0603  [R0603]
R655  8.2K  RESR0603  [R0603]
RP1  R-POTENTIOMETER  [3P-SQUA-45.6X10X5.8H]
SW1  switch_6pin  SWITCH_6PIN_2P  [SWITCH_6PIN_2P]
U2  LSM6DS3TR-C  LSM6DS3  [LGA-14L]
U4  KTH1701FH-ST3  A1101  [SOT-23W]
U6  RT9013-33GB-MS  RT9013  [SOT23-5]
U7  RT9013-33GB-MS  RT9013  [SOT23-5]
U8  MMDT3906  [SOT-363]
U9  DHT20  CROWTAIL-DHT20-V1.0-20211013_DHT20  [CROWTAIL-DHT20-V1.0-20211013_DHT20]
U13  SPL06-001  [LGA8-0.65-2X2.5X0.95MM]
U16  TCA9534APWR  [SOP65P640X120-16N]
U18  KT0210-QFN40-EP  [QFN40_EP]
U19  WMM7027ATSN1-4/TR  [LGA-4(1.9X2.8)]
U24  SN74LVC1G125  [SOT23-5]
U25  MT2492  [MT2492-SOT23-6]
U27  RP2040_RP2040  [RP2040_QFN-56]
U29  SELF_W25Q128JV  [SELF_SOIC-8-208MIL]
U31  STC8H1K28-36I-LQFP32  [QFP80P900X900X165-32N]
U35  MMDT3906  [SOT-363]
U39  PCF8574DWR(UMW)  PCF8574T/TR  [SO-16-300MIL]
U103  LPW5206AB5F  LPW5206B5F_SOT23-5  [IC_SOT23-5]
U114  ULN2003D  [ULN2003D]
U115  MFRC522  RC522  [RC522]
U121  BH1750  B1750  [B1750]
U123  TTP223  [SOT23-6L]
U125  LM358  IC_LM393_SOP8  [SOP8@1]
U126  BISS0001DRG  TM2291  [SOP16]
U131  D203S  PIR_MOTION_SENSOR_LHI778  [PIR_MOTION_SENSOR_3P-D8.1MM]
U205  HT16K33-20P  [HT16K33-SOP20]
U215  YY2841AS-33  4-DIGITAL_DISPLAY  [4-DIGITAL_DISPLAY]
U235  LCD1602  [LCD1206]
U$66  PADPAD1  [PAD_5*3]
U$69  PADPAD1  [PAD_5*3]
U$70  PADPAD1  [PAD_5*3]
U$71  PADPAD1  [PAD_5*3]
U$164  PADPAD1  [PAD_5*3]
U$165  PADPAD1  [PAD_5*3]
X2  12MHZ_SMD3225  A_XBJ_XTAL  [A_XBJ_SMD3225]
X102  27.12MHZ  CRYSTAL-3.2-2.5  [CRYSTAL-3.2-2.5]

### Nets
3V3_IO: J5.3 J6.3 J23.3 P41.P$1 P83.P$1 Q9.2(S) U8.4(E2)
5V_IO: J21.3 J22.3 P79.P$1 Q6.2(S) U35.4(E2)
5V_SERVO_1: J10.3 P35.P$1 Q8.3(D) R134.2
5V_SERVO_2: J9.3 P33.P$1 Q7.3(D) R133.2
+1V1: C23.1 C64.1 C86.1 U27.23(VDD_1V1) U27.45(LDO_OUT) U27.50(VDD_1V1)
+5V_SYS [PWR]: C16.2 C19.2 C30.2 C31.2 C32.1 C35.2 C40.1 C42.1 C45.1 C54.1 C56.1 C67.1 C69.1 C74.2 C176.1 FB9.2 J4.1 J4.1-1 J9.2 J10.2 J138.P$1 P36.P$1 P42.P$1 Q6.3(D) R17.1 R25.1 R29.1 R72.1 R73.1 R74.1 R87.1 R89.1 R127.1 R133.1 R134.1 R257.1 R259.1 R268.3 R283.1 R303.1 R324.1 SW1.2(2_COM2) U6.1 U6.3 U7.1 U7.3 U16.16(VCC) U18.7(VDD5V) U18.24(VDD5V_DRI) U25.5(IN) U35.1(E1) U39.P$16(VDD) U114.9(COM) U205.P$20 U235.P$2(2_VDD) U235.P$15(15_LEDA) ; also sheet 1
+5V_SYS_GAS: C25.2 J2.1(A) J2.2(H) J2.3(A) R101.2 SW1.3(3_2A)
A: U205.P$17 U215.11(11_A)
ADC_CH0: K5.P$2(COM1) P62.P$1 U31.1(ADC0/P1.0)
ADC_CH1: K5.P$5(COM2) P63.P$1 U31.2(ADC1/P1.1)
ADC_CH2: C21.2 P113.P$1 RP1.2 U31.3(ADC2/P1.2)
ADC_CH3: J2.4(B) J2.6(B) P116.P$1 R14.1 U31.4(ADC3/P1.3)
ADC_CH4: P61.P$1 R639.2 R652.2 R653.2 R654.2 R655.2 U31.5(ADC4/P1.4)
ADC_CH5: C26.2 P70.P$1 R15.1 R16.2 U31.6(ADC5/P1.5)
ANT1: R128.2 R129.2
AVDD: C136.1 R34.1 U27.43(ADC_VDD)
AVDD3V: C53.1 C76.2 U18.6(VDD2P8V) U18.27(VDD2P8V_CG)
B: U205.P$16 U215.7(7_B)
BOOT: K6.2 P10.P$1 P69.P$1 R35.2
BUZZER: P114.P$1 R284.1 U31.31(ADC10/P0.2)
C: U205.P$15 U215.4(4_C)
COM: J123.2 K10.2
D: U205.P$14 U215.2(2_D)
D2/I2C1_SDA: Q107.2(S) R18.1 R39.2 R240.2 R260.1 U2.14(SDA) U9.2(SDA) U13.3(SDA) U31.25(I2CSDA_2/P2.4) U121.4(SDA) ; also sheet 1
D3/I2C1_SCL: Q106.2(S) R19.1 R239.2 R258.1 R272.2 U2.13(SCL) U9.4(SCL) U13.4(SCL) U31.26(I2CSCL_2/P2.5) U121.6(SCL) ; also sheet 1
D4: P84.P$1 R298.2 R364.2 ; also sheet 1
D6: C33.1 P13.P$1 R63.1 U4.2(VOUT) ; also sheet 1
D8/SPI0_CS0: U115.24(SDA/NSS/RX) ; also sheet 1
D9/SPI0_MISO: U115.31(D7/MISO/SCL/TX) ; also sheet 1
D10/SPI0_MOSI: U115.30(D6/ADR_0/MOSI) ; also sheet 1
D11/SPI0_SCK: U115.29(D5/ADR_1/SCK/DTRQ) ; also sheet 1
D12/PWM: J6.1 P81.P$1 ; also sheet 1
D13/PWM: J5.1 P82.P$1 ; also sheet 1
D14/UART1_TXD: R125.1 ; also sheet 1
D15/UART1_RXD: R130.1 ; also sheet 1
D16/UART1_CTS: J233.P$3(3_TRIG) P111.P$1 ; also sheet 1
D17/UART1_RTS: P55.P$1 R287.2 ; also sheet 1
D18/I2S0_SCLK: P27.P$1 R24.2 ; also sheet 1
D20/I2S0_SDIN: J12.3 P112.P$1 R140.1 ; also sheet 1
D23/SPI1_CS1: P57.P$1 R189.1 R254.2 ; also sheet 1
D25/SPI1_MISO: P109.P$1 U125.1(1_OUT1) U125.2(2_IN1-) ; also sheet 1
D26/SPI1_MOSI: P110.P$1 R299.2 ; also sheet 1
D27/SPI1_SCK: P2.P$1 R282.1 ; also sheet 1
DB4: U39.P$9(P4) U235.P$11(11_D4)
DB5: U39.P$10(P5) U235.P$12(12_D5)
DB6: U39.P$11(P6) U235.P$13(13_D6)
DB7: U39.P$12(P7) U235.P$14(14_D7)
DIG1: U205.P$2 U215.12(12_COM1)
DIG2: U205.P$3 U215.9(9_COM2)
DIG3: U205.P$4 U215.8(8_COM3)
DIG4: U205.P$5 U215.6(6_COM4)
DIS_RGB: P74.P$1 U27.41(GPIO29/ADC3)
DP: U205.P$10 U215.3(3_DP)
E: U205.P$13 U215.1(1_E)
E_LCD: U39.P$6(P2) U235.P$6(6_E)
ENCODER_A: C38.1 P59.P$1 R64.1 U16.11(P6)
ENCODER_B: C39.2 P60.P$1 R65.1 U16.12(P7)
ENCODER_SW: C66.2 R71.1 R74.2 U16.10(P5)
F: U205.P$12 U215.10(10_F)
G: U205.P$11 U215.5(5_G)
GND [PWR]: C15.1 C16.1 C18.1 C19.1 C20.2 C21.1 C22.2 C23.2 C24.2 C25.1 C26.1 C27.1 C28.1 C29.1 C30.1 C31.1 C32.2 C33.2 C34.1 C35.1 C36.1 C37.2 C38.2 C39.1 C40.2 C41.1 C42.2 C44.2 C45.2 C49.1 C53.2 C54.2 C55.1 C56.2 C58.1 C64.2 C66.1 C67.2 C68.2 C69.2 C70.2 C71.2 C72.2 C73.1 C74.1 C75.1 C76.1 C77.1 C78.1 C86.2 C88.2 C95.2 C101.2 C102.1 C105.1 C106.2 C111.1 C112.1 C133.2 C134.1 C135.2 C136.2 C138.2 C139.2 C144.2 C145.2 C146.2 C147.2 C148.2 C149.2 C166.2 C176.2 C177.1 C178.1 C179.1 C209.1 C212.1 C213.1 C214.1 C220.1 C221.1 C225.1 C226.2 C227.2 C228.2 EC1.2(C) EC1.4(GND) J1.3 J1.3-1 J3.1(-) J3.3(E) J4.3 J4.3-1 J5.4 J5.SS1 J5.SS2 J6.4 J6.SS1 J6.SS2 J9.1 J10.1 J12.2 J14.2 J14.4 J14.5 J14.6 J21.4 J21.SS1 J21.SS2 J22.4 J22.SS1 J22.SS2 J23.4 J23.SS1 J23.SS2 J138.P$6 J138.P$7 J233.P$1(1_GND) K1.P$1 K2.P$1 K3.P$1 K4.P$1 K6.1 K7.1 K11.1 LED6.- P17.P$1 P32.P$1 P37.P$1 P38.P$1 P43.P$1 P73.P$1 P80.P$1 Q3.2(E) Q5.2(E) Q103.2(E) Q104.2(E) Q108.2(E) Q115.2(E) R1.2 R13.1 R14.2 R15.2 R21.1 R23.2 R30.1 R31.1 R42.1 R75.2 R76.2 R77.2 R82.1 R83.1 R94.2 R100.2 R105.2 R108.1 R109.1 R111.1 R189.2 R238.1 R242.1 R250.2 R256.1 R268.1 R273.1 R280.1 R286.2 R288.2 R302.1 RP1.1 U2.6(GND) U2.7(GND) U4.3(GND) U6.2 U7.2 U9.3(GND) U13.1(GND) U13.7(GND) U16.1(A0) U16.2(A1) U16.8(GND) U18.16(DVSS) U18.34(AUGND) U18.39(DRVSS) U18.41(GND) U19.2(GND) U19.3(GND) U24.1(OE) U24.3(GND) U25.2(GND) U27.19(TESTEN) U27.EPAD(GND) U29.4(GND) U31.12(GND/AGND) U39.P$8(VSS) U103.2(2_GND) U114.8(GND) U115.1(I2C) U115.4(DVSS) U115.5(PVSS) U115.10(TVSS) U115.14(TVSS2) U115.18(AVSS) U115.33(GND) U121.3(GND\) U123.2(GND) U125.4(4_GND) U126.7(VSS) U131.3(G) U205.P$1 U235.P$1(1_VSS) X2.2(GND) X2.4(GND) X102.2(GND) X102.4(GND) ; supply symbol labelled POWER-OR-GND-_GND_POWER ; also sheet 1
IN1: C212.2 P101.1 U123.3(IN)
IN1+: R28.2 U125.3(3_IN1+) U125.7(7_OUT2)
INT1: P66.P$1 U2.4(INT1)
INT2: P104.P$1 U2.9(INT2)
IO_RGB: P75.P$1 U27.29(GPIO18)
IO_RGB_POWER_EN: P76.P$1 U27.40(GPIO28/ADC2)
ITR9606_IN: C41.2 J3.4(C) P25.P$1 R27.2 U125.6(6_IN2-)
JS_3V3 [PWR]: C15.2 C18.2 C24.1 C27.2 C28.2 C34.2 C37.1 C58.2 C70.1 C177.2 C178.2 C213.2 C214.2 C220.2 C226.1 J1.1 J1.1-1 J12.1 J233.P$4(4VCC) Q7.1(G) Q8.1(G) Q9.3(D) Q106.1(G) Q107.1(G) R16.1 R18.2 R19.2 R22.2 R26.1 R27.1 R28.1 R43.2 R45.1 R63.2 R84.1 R85.1 R113.2 R131.2 R132.2 R140.2 R237.2 R239.1 R240.1 R249.2 R251.2 R255.2 R308.1 R325.1 R364.1 R639.1 RP1.3 U2.5(VDDIO) U2.8(VDD) U4.1(VCC) U8.1(E1) U9.1(VCC) U13.6(VDDIO) U13.8(VDD) U31.10(VCC/AVCC) U31.11(ADC_VREF+) U115.2(PVDD) U115.3(DVDD) U115.12(TVDD) U115.15(AVDD) U121.1(VCC) U123.5(VCC) U125.8(8_VCC) U126.11(VDD) U131.1(D) ; also sheet 1
LIGHT: R321.2 U39.P$7(P3)
MIC_3V3 [PWR]: C49.2 U7.5 U19.4(VDD)
MIC_BIAS: C51.1 R79.1 R110.1 U18.3(MIC_BIAS)
MIC_IN: C50.2 R110.2 U18.2(KEY_IN)
MIC_USB_D+: R116.1 ; also sheet 1
MIC_USB_D-: R115.1 ; also sheet 1
N$1: LED1.+ R81.1
N$2: R1.1 U35.2(B1) U35.5(B2) U35.6(C1)
N$10: R17.2 U39.P$1(A0)
N$11: R87.2 U39.P$2(A1)
N$12: R89.2 U39.P$3(A2)
N$13: P6.P$1 U31.21(P2.0)
N$14: P5.P$1 U31.22(P2.1)
N$15: P4.P$1 U31.23(P2.2)
N$16: P3.P$1 U31.24(P2.3)
N$17: J1.2 J1.2-1 R135.1
N$18: J1.4 J1.4-1 R136.1
N$19: R42.2 R268.2 U235.P$3(3_V0)
N$20: Q5.3(C) U235.P$16(16_LED_K)
N$21: Q108.1(B) R77.1 R321.1
N$22: R82.2 U2.2(SDX)
N$23: J2.5(H) R13.2
N$24: C133.1 U27.20(XIN) X2.1(XIN)
N$25: Q3.1(B) R21.2 R24.1
N$26: EC1.5(SW) R71.2
N$27: R244.1 R245.1
N$28: R251.1 U126.8(!RESET)
N$29: J3.2(+) R22.1
N$30: R105.1 U103.3(3_SET)
N$31: R26.2 R94.1 U125.5(5_IN2+)
N$32: R221.2 U24.2(IN_A)
N$33: R29.2 U16.13(INT)
N$34: C209.2 R113.1 U121.5(DVI)
N$35: R127.2 U16.3(A2)
N$36: K5.P$1 R23.1
N$37: C100.1 R328.1
N$38: K5.P$6 R30.2
N$40: K5.P$3 R43.1
N$41: K5.P$4 R45.2
N$44: R33.2 U27.21(XOUT)
N$47: P105.P$1 U27.2(GPIO0)
N$48: J313.P$2 Q104.3(C)
N$49: P106.P$1 U27.3(GPIO1)
N$50: P107.P$1 U27.4(GPIO2)
N$56: Q6.1(G) R75.1 U35.3(C2)
N$57: R100.1 U8.2(B1) U8.5(B2) U8.6(C1)
N$60: R83.2 U2.3(SCX)
N$67: R84.2 U2.12(CS)
N$68: P108.P$1 U27.5(GPIO3)
N$70: D11.2(C) Q3.3(C)
N$73: Q9.1(G) R76.1 U8.3(C2)
N$79: K11.2 R298.1
N$80: C129.1 L14.1 U25.6(SW)
N$81: LED6.+ R101.1
N$83: D11.1(A) R25.2
N$86: R85.2 U2.1(SDO)
N$87: C50.1 R79.2 R102.1 U19.1(OUT)
N$88: C51.2 C52.2 U18.4(DRVSS_SNS)
N$89: R31.2 U13.5(SDO)
N$90: R108.2 R219.1 U25.3(BF)
N$93: Q108.3(C) R32.2 R324.2
N$94: C129.2 U25.1(BS)
N$95: R107.2 R109.2 U25.4(EN)
N$96: Q5.1(B) R32.1
N$98: C52.1 U18.5(VREF_1P8V)
N$99: FB10.2 U18.8(DCDC1_SW)
N$102: C71.1 FB10.1 U18.9(DVDD1V)
N$107: C72.1 U18.10(DVDD3V)
N$109: R111.2 U18.13(GPIO6)
N$110: R115.2 U18.22(DM)
N$111: R116.2 U18.21(DP)
N$112: C73.2 U18.23(VDD3V_USB)
N$113: FB6.1 U18.25(DCDC2_SW)
N$114: C75.2 FB6.2 U18.26(VDD1P8V_CP)
N$115: R104.1 U103.4(4_EN)
N$116: C77.2 U18.29(CHP)
N$117: C78.2 U18.28(CHN)
N$118: C79.1 U18.31(CFLYP)
N$120: C79.2 U18.30(CFLYN)
N$121: C134.2 R33.1 X2.3(XOUT)
N$129: C80.1 U18.35(VINP)
N$130: C81.1 U18.36(VINN)
N$131: P28.P$1 U18.12(GPIO4)
N$132: P29.P$1 U18.11(GPIO3)
N$166: K1.P$2 R652.1
N$168: K2.P$2 R653.1
N$169: K3.P$2 R654.1
N$172: K4.P$2 R655.1
N$201: R39.1 U27.31(GPIO20)
N$205: R272.1 U27.32(GPIO21)
N$258: R237.1 R238.2 U121.2(ADDR)
N$259: Q115.1(B) R112.2 R273.2
N$263: C29.2 J313.P$1 R283.2
N$264: R288.1 U123.4(AHLB) U123.6(TOG)
N$266: Q104.1(B) R280.2 R282.2
N$267: R286.1 R287.1 U123.1(OUT)
N$274: J138.P$2 R297.2
N$275: J138.P$3 R292.2
N$276: J138.P$4 R293.2
N$277: J138.P$5 R294.2
N$278: J233.P$2(2_ECHO) R299.1
N$279: Q103.1(B) R284.2 R302.2
N$280: BUZ1.2(2-) D001.+ Q103.3(C)
N$281: BUZ1.1(1+) C55.2 D001.- R303.2
N$282: R253.1 U126.3(RR1)
N$287: C228.1 R253.2 U126.4(RC1)
N$288: R254.1 U126.2(VO)
N$289: R252.1 U126.6(RR2)
N$290: C227.1 R252.2 U126.5(RC2)
N$291: C222.1 R245.2 R245.3 U126.12(2OUT)
N$292: C222.2 R244.2 R246.2 U126.13(2IN-)
N$293: R249.1 U126.9(VC)
N$294: R250.1 U126.10(IB)
N$295: C221.2 R242.2 R243.1 U131.2(S)
N$296: C223.2 C224.1 R247.1 U126.16(1OUT)
N$297: C224.2 R247.2 R248.2 U126.15(1IN-)
N$298: C223.1 R246.1
N$299: C225.2 R248.1
N$300: R255.1 R256.2 U126.1(A)
N$301: R243.2 U126.14(1IN+)
N$306: C111.2 U115.22(OSCOUT) X102.1(C1)
N$307: C179.2 U115.21(OSCIN) X102.3(C2)
N$308: C112.2 R367.1 U115.16(VMID)
N$309: C100.2 R367.2 U115.17(RX)
N$310: L104.1 U115.13(TX2)
N$311: L103.1 U115.11(TX1)
N$312: C101.1 C109.2 L103.2 R328.2
N$313: C102.2 C107.2 L104.2
N$314: R325.2 U115.6(NRSTPD)
N$315: R308.2 U115.32(EA)
N$318: C105.2 C109.1 R128.1
N$319: C106.1 C107.1 R129.1
NC: J123.1 K10.4
NO: J123.3 K10.5
OUT1_S: P47.P$1 R297.1 U114.16(OUT1)
OUT2_S: P46.P$1 R292.1 U114.15(OUT2)
OUT3_S: P45.P$1 R293.1 U114.14(OUT3)
OUT4_S: P44.P$1 R294.1 U114.13(OUT4)
QSPI_CS: R35.1 R36.1 U27.56(QSPI_!CS!) U29.1(/CS)
QSPI_D0: U27.53(QSPI_SD0) U29.5(DI(IO0))
QSPI_D1: U27.55(QSPI_SD1) U29.2(DO(IO1))
QSPI_D2: U27.54(QSPI_SD2) U29.3(/WP(IO2))
QSPI_D3: U27.51(QSPI_SD3) U29.7(/HOLD/RESET(IO3))
QSPI_SCK: U27.52(QSPI_SCLK) U29.6(CLK)
RELAY: P115.P$1 R112.1 U31.30(ADC9/P0.1)
RESET: C20.1 K7.2 P26.P$1 R231.1 U27.26(RUN)
RGB_CTRO: J14.3 P56.P$1 U24.4(Y)
RING2: C80.2 U18.37(RING2_REF) U18.38(RING2)
RP2040_3V3: C22.1 C68.1 C88.1 C138.1 C139.1 C144.1 C145.1 C146.1 C148.1 C149.1 R34.2 R36.2 R231.2 U6.5 U27.1(VDDIO) U27.10(VDDIO) U27.22(VDDIO) U27.33(VDDIO) U27.42(VDDIO) U27.44(LDO_IN) U27.48(USB_VDD) U27.49(VDDIO) U29.8(VCC)
RP2040_IO6_RGB: P34.P$1 R221.1 U27.8(GPIO6)
RP2040_IO13_SERVO_1: Q8.2(S) R132.1 U27.16(GPIO13)
RP2040_IO14_SERVO_2: Q7.2(S) R131.1 U27.17(GPIO14)
RP2040_IO27_RGB_POWER_EN: P31.P$1 R107.1 U27.39(GPIO27/ADC1)
RS: U39.P$4(P0) U235.P$4(4_RS)
RW: U39.P$5(P1) U235.P$5(5_RW)
RX: J23.2 P40.P$1 R130.2
SA: EC1.1(A) R64.2 R72.2
SB: EC1.3(B) R65.2 R73.2
SCL: J21.1 J22.1 P78.P$1 Q106.3(D) R257.2 R258.2 U16.14(SCL) U39.P$14(SCL) U205.P$18
SDA: J21.2 J22.2 P77.P$1 Q107.3(D) R259.2 R260.2 U16.15(SDA) U39.P$15(SDA) U205.P$19
SLEEVE: C81.2 R102.2 U18.1(SLE_REF) U18.40(SLEEVE)
STC8_RXD: R135.2 U31.13(P3.0/RXD)
STC8_TXD: R136.2 U31.14(P3.1/TXD)
STEP1: U16.4(P0) U114.1(IN1)
STEP2: U16.5(P1) U114.2(IN2)
STEP3: U16.6(P2) U114.3(IN3)
STEP4: U16.7(P3) U114.4(IN4)
TX: J23.1 P39.P$1 R125.2
USB_D+ [USB]: J4.4 J4.4-1 U27.47(USB_D+)
USB_D- [USB]: J4.2 J4.2-1 U27.46(USB_D-)
V+: K10.1 R276.2
V-: D003.+ K10.3 LED1.- Q115.3(C)
VCC_DIS_RGB: C135.1 C147.1 L14.2 P1.P$1 R104.2 R106.1 R219.2 U103.5(5_VIN)
VCC_RELAY: C36.2 D003.- FB9.1 R81.2 R276.1
VCC_RGB: C44.1 C95.1 C166.1 J14.1 P30.P$1 R106.2 U24.5(VCC) U103.1(1_OUT)
Unconnected: J5.2 J6.2 SW1.1(1_2B) SW1.4(4_1A) SW1.5(5_COM1) SW1.6(6_1B) U6.4 U7.4 U16.9(P4) U18.14(GPIO7) U18.15(GPIO8) U18.17(NRST) U18.18(NC) U18.19(GPIO9) U18.20(GPIO10) U18.32(RING1_ROUT) U18.33(TIP_LOUT) U27.6(GPIO4) U27.7(GPIO5) U27.9(GPIO7) U27.11(GPIO8) U27.12(GPIO9) U27.13(GPIO10) U27.14(GPIO11) U27.15(GPIO12) U27.18(GPIO15) U27.24(SWCLK) U27.25(SWDIO) U27.27(GPIO16) U27.28(GPIO17) U27.30(GPIO19) U27.34(GPIO22) U27.35(GPIO23) U27.36(GPIO24) U27.37(GPIO25) U27.38(GPIO26/ADC0) U31.7(ADC6/P1.6) U31.8(ADC7/P1.7) U31.9(P5.4) U31.15(P3.2) U31.16(P3.3) U31.17(P3.4) U31.18(P3.5) U31.19(P3.6) U31.20(P3.7) U31.27(P2.6) U31.28(P2.7) U31.29(ADC8/P0.0) U31.32(ADC11/P0.3) U39.P$13(INT#) U114.5(IN5) U114.6(IN6) U114.7(IN7) U114.10(OUT7) U114.11(OUT6) U114.12(OUT5) U115.7(MFIN) U115.8(MFOUT) U115.9(SVDD) U115.19(AUX1) U115.20(AUX2) U115.23(IRQ) U115.25(D1/ADR_5) U115.26(D2/ADR_4) U115.27(D3/ADR_3) U115.28(D4/ADR_2) U205.P$6 U205.P$7 U205.P$8 U205.P$9 U235.P$7(7_D0) U235.P$8(8_D1) U235.P$9(9_D2) U235.P$10(10_D3) U$66.P$1 U$69.P$1 U$70.P$1 U$71.P$1 U$164.P$1 U$165.P$1

### Notes on the sheet
- MIC | RP2040_MCU MIN System
- USB | I2C ADD:0x66
- PWR-CTL:RP2040_IO27
  DIN:RP2040_IO6
- Boot:
- RESET=0时，按下Boot-下载模式
- Boot=1,正常运行
- 下载器为5V供电
- Crowtail_IO
- LED
- W25Q32 | D18
- SERVO*2 | ok
- I2C-RP2040-IO14&13
- 8*8RGB_LED
- STC8
- ok
- RGB_PWR:RP2040_IO26
- I2C | ADD:0X2D
- RGB-DIN:PR2040_IO6
- 4.5V
- I=6.8/R1
- Vout=0.6x(1+R1/R2)
- I/O Expander TCA9534A
- ok
- I2C | ADD:0X3C
- ADDRESS:0111XXX
- ADDRESS:0X3C
- Photoelectric Counter | HALL SENSOR | Stepper Motor
- ok | ok
- D25 | D6
- I2C-EX-IO
- Encoder
- ok
- I2C-EX-IO-P7&65
- 结构板固定焊盘
- ok
- Ultrasonic Sensor | Buzzer | ok | Relay | IR Remote Sensor | Vibration sensor | Touch Sensor
- ok | ok | ok
- ok | ok
- D16&D26 | I2C-EXIO-STC8-P0.2 | I2C-EXIO-STC8-P0.1 | D20 | D27 | D17
- TTP223
- Tilt sensor | Custom_key | Joystick | Linear Potentiometer | GAS-MQ2
- ok | ok | ok | ok | NTC
- ok | ADC_CH4 | ADC_CH0&1 | ok
- D4 | ADC_CH2 | ADC_CH3 | ADC_CH5
- 开关控制传感器功能的开启或关闭
- sliver | gold
- Barometer | Accelerometer&Gyro
- I2C_LCD
- ok | ok
- I2C | ADD:0X76 | I2C | ADD:0X6B
- I2C | ADD:0x27
- ok
- D23
- PIR-Motion sensor | ok
- ADDRESS:0X76
- NFC
- ok
- SPI0
- 低电平开启背光高电平关闭
- Temperature & Humidity(DHT20) | LIGHT SENSOR | Digital display
- ok | I2C | ADD:0X70 | ok
- I2C | ADD:0X38 | I2C | ADD:0X5C
- ADDRESS:1110000
- ok
- ADDRESS:0X70
- 2.7V-4.2V
- 3V-5.5V
- ADDRESS:0111000
- ADDRESS:1011100
- ADDRESS:0X38
- ADDRESS:0x5C

## Power pins joined to a net without a drawn wire
CSB: U13.2(CSB)

## Library data of the parts
BUZ1 = Brian:BUZZER
C1 C4 C7 C8 C15-C48 C54 C55 C58 C64 C66-C70 C82-C86 C88 C90 C91 C93 C95 C100-C102 C105-C107 C109 C111 C112 C123 C124 C129 C133-C140 C144-C166 C176-C179 C184-C192 C201-C209 C212-C214 C220-C228 C248 = Brian:CAP*
C2 C3 C5 C6 C9-C14 = LoraWAN_Gateway_Mainboard:CAP*
C49-C53 C56 C71-C81 = Discrete:C*: Ceramic Capacitors
D001 D003 = Crowtail_Starter:DIODE*
D11 = Crowtail_Starter:LED: LED (Generic) Standard schematic elements and footprints for 5mm, 3mm, 1206, and 0603 sized LEDs. Generic LEDs with no color specified.
D502 = DO-214AB:214AB: 214AB
EC1 = template:ROTARY-ENCODE-5P: Rotary Encode With Switch http://www.seeedstudio.com/depot/rotary-encoder-with-switch-p-667.html?cPath=156_160
FB1 FB2 FB7-FB9 = Brian:FB*
FB3-FB5 FB10 = LoraWAN_Gateway_Mainboard:FB*
FB6 L1 L3 = LoraWAN_Gateway_Mainboard:L*
FPC1 = Brian:FPC_24PIN_0.5_4.3_1
FPC4 = Brian:NV116WHM
FPC10 = Brian:FPC_22PIN_0.5_4.3_1
FPC11 = Brian:FPC_15P_1.0
J1 J4 = Brian:H_2*2_2.54
J2 = Brian:MQ-SOCKET
J3 = Brian:KLH-512L
J5 J6 J21-J23 = Connector:TWIG-4P-2.0-SMD-FEMALE-REINFORCE
J9 J10 = SparkFun-Connectors:CONN_03: Multi connection point. Often used as Generic Header-pin footprint for 0.1 inch spaced/style header connections On any of the 0.1 inch spaced packages, you can populate with these: Break Away Headers - Straight <https://www.sparkfun.com/products/116> (PRT-00116) Break Away Male Headers - Right Angle <https://www.sparkfun.com/products/553> (PRT-00553) Female Headers <https://www.sparkfun.com/products/115> (PRT-00115) Break Away Headers - Machine Pin <https://www.sparkfun.com/products/117> (PRT-00117) Break Away Female Headers - Swiss Machine Pin <https://www.sparkfun.com/products/743> (PRT-00743) Stackable Header - 3 Pin (Female, 0.1") <https://www.sparkfun.com/products/13875> (PRT-13875) For SCREWTERMINALS and SPRING TERMINALS visit here: Screw Terimnals on SparkFun.com <https://www.sparkfun.com/search/results?term=Screw+Terminals> (5mm/3.5mm/2.54mm spacing) This device is also useful as a general connection point to wire up your design to another part of your project. Our various solder wires solder well into these plated through hole pads. Hook-Up Wire - Assortment (Stranded, 22 AWG) <https://www.sparkfun.com/products/11375> (PRT-11375) Hook-Up Wire - Assortment (Solid Core, 22 AWG) <https://www.sparkfun.com/products/11367> (PRT-11367) View the entire wire category on our website here <https://www.sparkfun.com/categories/141> Special notes: Molex polarized connector foot print use with SKU : PRT-08232 with associated crimp pins and housings.; PROD_ID: XXX-00000; VALUE: 455-1750-1-ND
J11 = SparkFun-Connectors:CONN_20X2: Multi connection point. Often used as Generic Header-pin footprint for 0.1 inch spaced/style header connections On any of the 0.1 inch spaced packages, you can populate with these: Break Away Headers - Straight <https://www.sparkfun.com/products/116> (PRT-00116) Break Away Male Headers - Right Angle <https://www.sparkfun.com/products/553> (PRT-00553) Female Headers <https://www.sparkfun.com/products/115> (PRT-00115) Break Away Headers - Machine Pin <https://www.sparkfun.com/products/117> (PRT-00117) Break Away Female Headers - Swiss Machine Pin <https://www.sparkfun.com/products/743> (PRT-00743)
J12 = Crowtail_Starter:IR-3P
J14 = MY_LIB:RGB64*64AMD
J15 = Brian:CONN_04
J123 = Crowtail_Starter:3.5MM*3P
J138 = untitled:CROWPI_POW_SMD-2.54MM*5P
J214 J215 = Crotail:1X02L
J233 = crowpi_pow:ULTRA
J313 = Brian:MOTOR_1CN
K1-K4 = crowpi_pow:BUTTON_2P
K5 = crowpi_pow:ROCKER
K6 K7 = MySMD:PB157
K10 = Discrete-new:RELAY-SRD
K11 = crowpi_pow:TILT-DIP-2P
L2 = Lora_RA-08H_Node_ Board:L*
L14 = CD54:CD32_950MA
L103 L104 = Discrete:L*
LED1 LED3-LED6 = A_xbj:DISCRETE_LED*
M1-M4 = Brian:M2
P1-P65 P67-P100 P102 P105-P117 = crowpi_pow:PAD*
P66 P104 = LoraWAN_Gateway_Mainboard:TEST_PAD*
P101 = Discrete:PAD
Q1 = Lora_RA-08H_Node_ Board:TRANS_NPN: NPN transistor Current controlled devices typically used to amplify current or used as a switch. BC547 - COM-08928 <http://www.sparkfun.com/products/8928> (TO-92 45V 100mA) (1.Collector 2.Base 3.Emitter) 2N3904 - COM-00521 <http://www.sparkfun.com/products/521> (TO-92 40V 200mA) (1.Emitter 2.Base 3.Collector) P2N2222A - COM-12852 <http://www.sparkfun.com/products/12852> (TO-92 40V 600mA) (1.Collector 2.Base 3.Emitter); PROD_ID: TRANS-09116; VALUE: 500mA/300V
Q2 Q6 Q9 = Lora_RA-08H_Node_ Board:MOSFET-P: IRLL014: http://www.vishay.com/docs/91319/sihll014.pdf
Q3 = discrete:TRANSISTOR-NPN*: NPN audion
Q4 Q5 Q101-Q104 Q108 Q112 Q115 = Discrete:TRANSISTOR-NPN*: NPN audion
Q7 Q8 Q106 Q107 = Discrete:MOSFET-N: IRLL014: http://www.vishay.com/docs/91319/sihll014.pdf
R1-R14 R16-R43 R45 R49-R54 R57 R58 R61-R77 R81-R85 R87-R101 R103-R109 R112-R114 R125-R136 R140 R153-R155 R178-R189 R209 R210 R213 R216-R219 R221 R231-R240 R242-R244 R246-R260 R272 R273 R276 R280 R282-R284 R286-R288 R292-R294 R297-R299 R302 R303 R308 R321 R324 R325 R328 R332 R364 R367 R501 R502 R514 R639 R652-R655 = Brian:RES*
R15 = AI_Starter_Jetson:MF52A103F3950
R79 R102 R110 R111 R115 R116 = cooper:R0603
R245 R268 RP1 = Discrete:R-POTENTIOMETER*: Potentiometer
SW1 = cooper:SWITCH_6PIN_2P
U1 = LoraWAN_Gateway_Mainboard:MT2492-SOT23-6
U2 = Brian:LSM6DS3
U4 = IC:A1101: Continuous-Time Switch
U6 U7 = Brian:RT9013
U8 U35 = Brian:MMDT3906
U9 = Crowtail_Starter:CROWTAIL-DHT20-V1.0-20211013_DHT20
U11 = SX1302_Module:MT3520B
U13 = Brian:SPL06-001: Digital Pressure Sensor; MPN: SPL06-001
U16 = ltd2660:TCA9534APWR
U17 = Pico Display-7.0v0.1:LORA_RA-08H_DEV_SELF_W25Q128JV
U18 = AI_Starter_Jetson:KT0210-QFN40-EP
U19 = AI_Starter_Jetson:WMM7027ATSN1-4/TR
U24 = MY_LIB:SN74LVC1G125
U25 = MT2492:MT2492
U27 = Lora_RA-08H_Dev:RP2040_RP2040: Raspberry Pi RP2040 MCU 56-pin 32-bit Microcontroller with 264kB of SRAM and external flash support up to 16MB Getting Started with the RP2040 <https://pico.raspberrypi.org/getting-started/> Dual-core ARM Cortex M0+ processor, flexible clock running up to 133 MHz 264kB of SRAM, and QSPI control of common flash memory USB 1.1 Host and Device support Low-power sleep and dormant modes Drag & drop programming using mass storage over USB 26 multi-function GPIO pins 2×SPI, 2×I2C, 2×UART, 3×12-bit ADC, 16×controllable PWM channels Accurate clock and timer on-chip Temperature sensor Accelerated floating point libraries on-chip 8×Programmable IO (PIO) state machines for custom peripheral support; PROD_ID: IC-15502
U29 = Lora_RA-08H_Dev:SELF_W25Q128JV
U31 = Brian:STC8H1K28-36I-LQFP32
U39 = Brian:PCF8574T/TR
U103 = cooper:LPW5206B5F_SOT23-5
U114 = b1750:ULN2003D
U115 = relay_matrix:RC522
U119 = cooper:IC_RTD2556_LQFP156_14X20
U120 = cooper:PAM8602E_SSOP24
U121 = b1750:B1750; B1750: B1750
U123 = Seeed:TTP223
U125 = cooper:IC_LM393_SOP8
U126 = PIR_motion_sensor:TM2291: Infrared signal processor
U131 = Crowpi_laptop-MB-V1.0-20200623-01:PIR_MOTION_SENSOR_LHI778: Pyroelectric Infrared Detectors
U205 = crowpi_pow:HT16K33-20P
U215 = crowpi_pow:4-DIGITAL_DISPLAY
U235 = crowpi_pow:LCD1602
U501 = crowpi_pow:MT3608
U$66 U$69-U$71 U$164 U$165 = Brian:PAD
X2 = CrowBot_V1.4:A_XBJ_XTAL
X101 X102 = SmartPrj:CRYSTAL-3.2-2.5

## Net classes
0 default: width 0.1 mm, drill 0.3 mm
1 PWR: width 0.4 mm, drill 0.25 mm
2 gnd: width 0.15 mm, drill 0.3 mm, clearance 0.152 mm
4 USB: width 0.203 mm, clearance 0.152 mm